# Altium project Board.PrjPcb
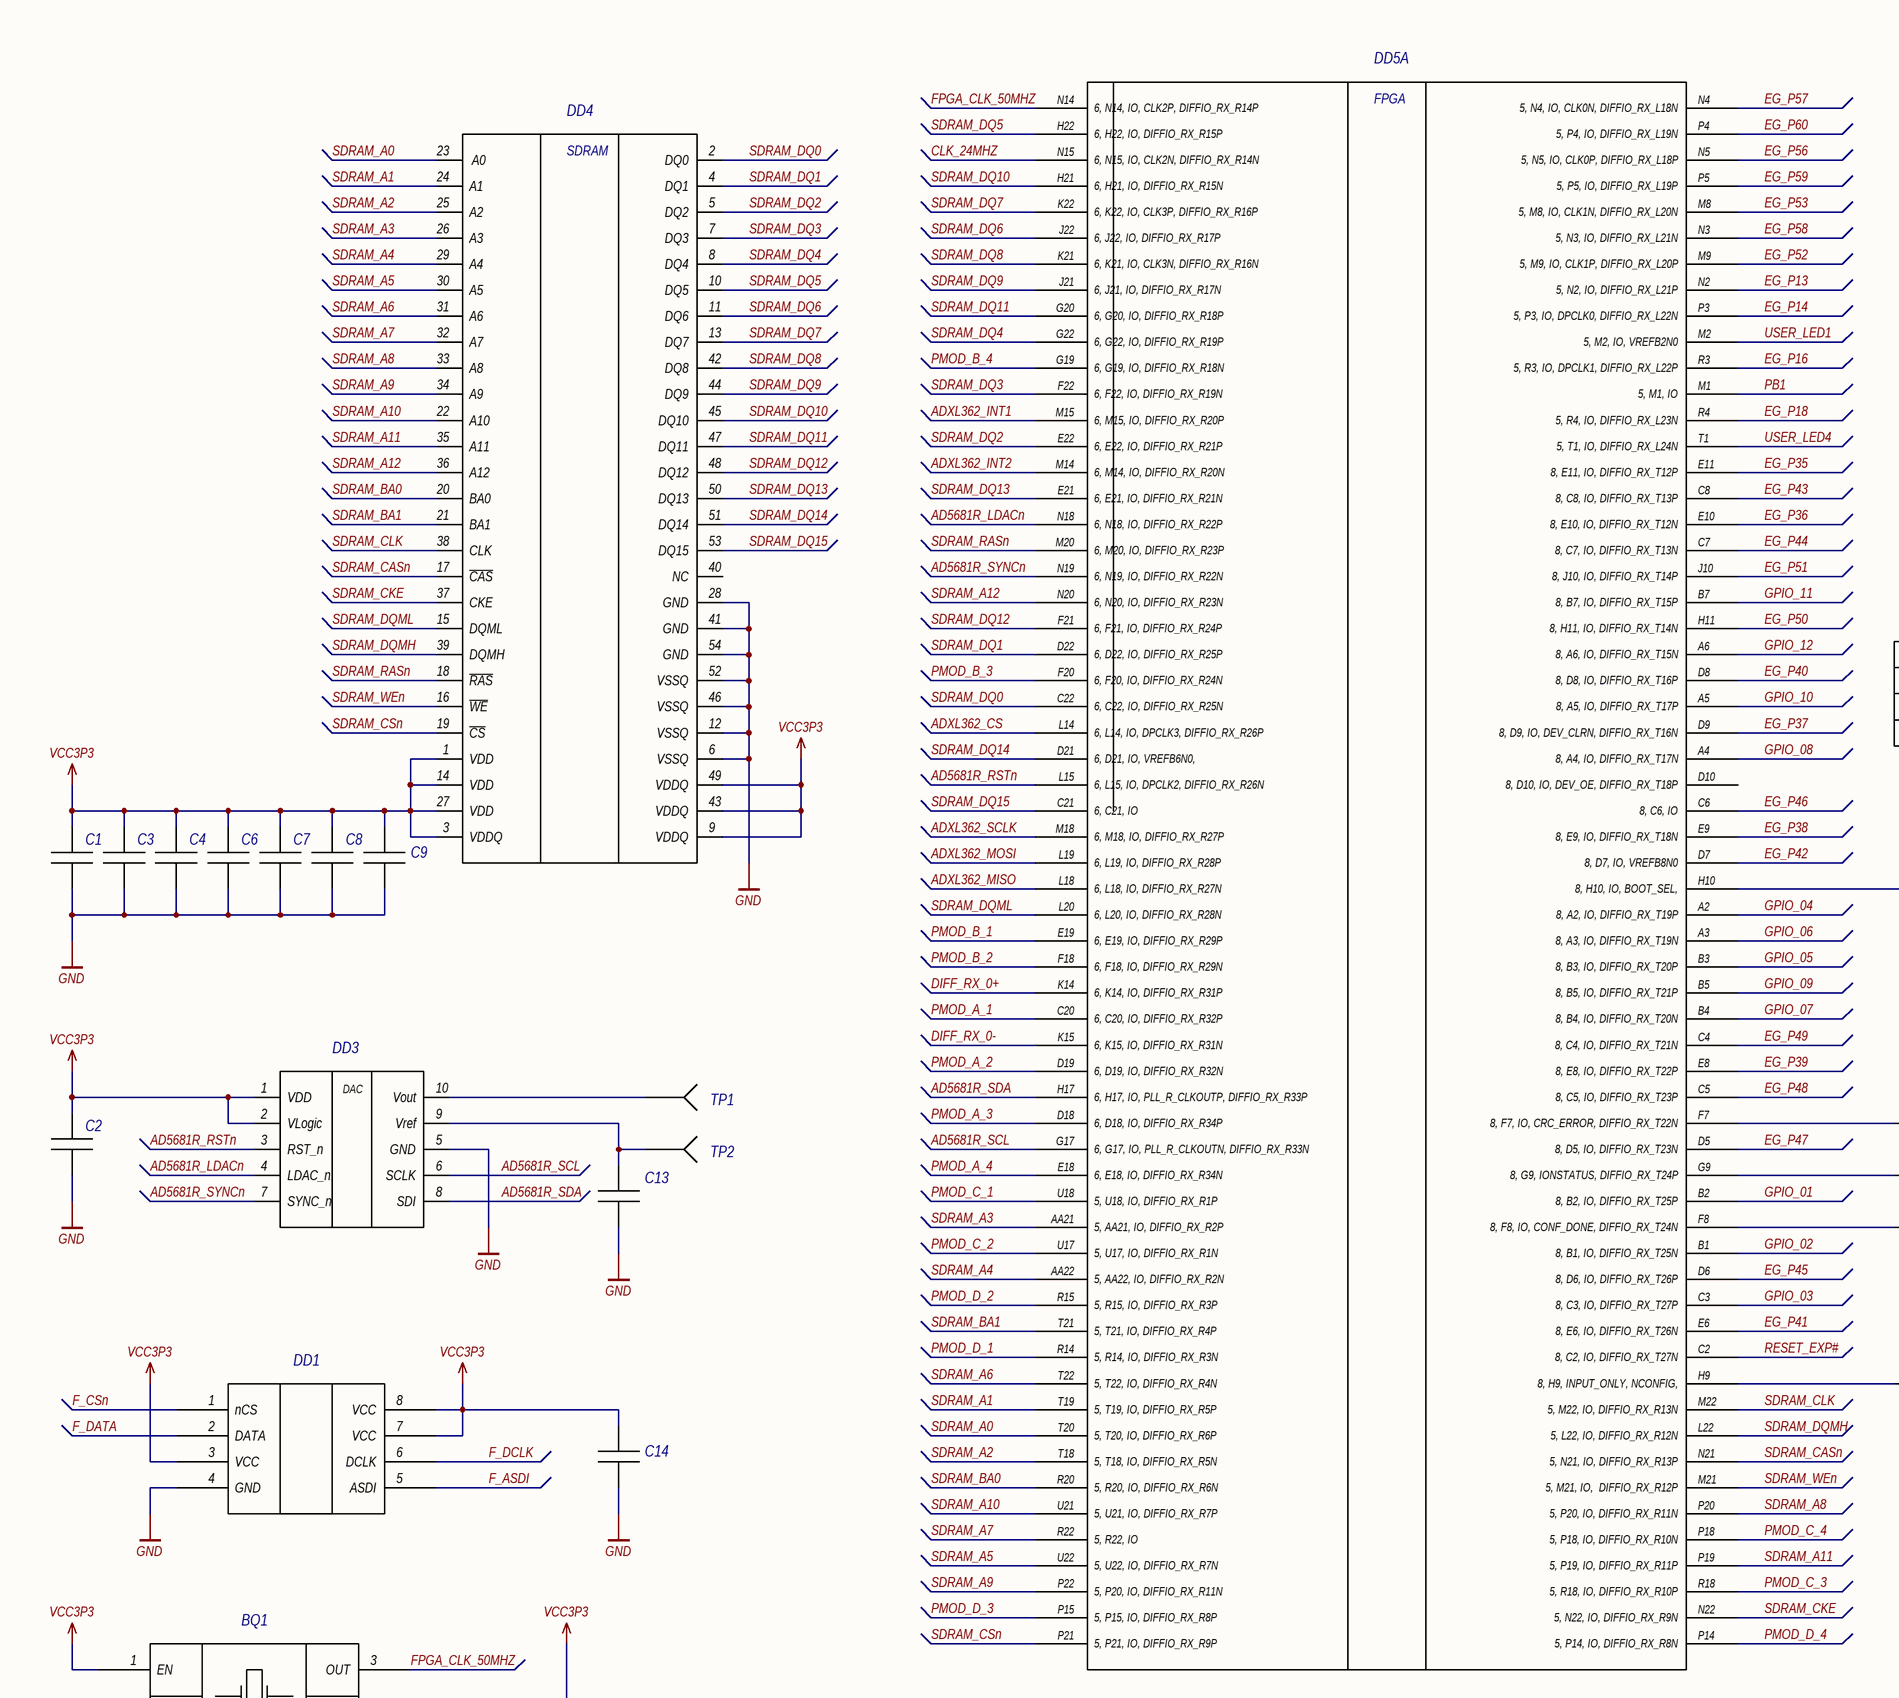
[diagram p0: 01.SchDoc, top left]
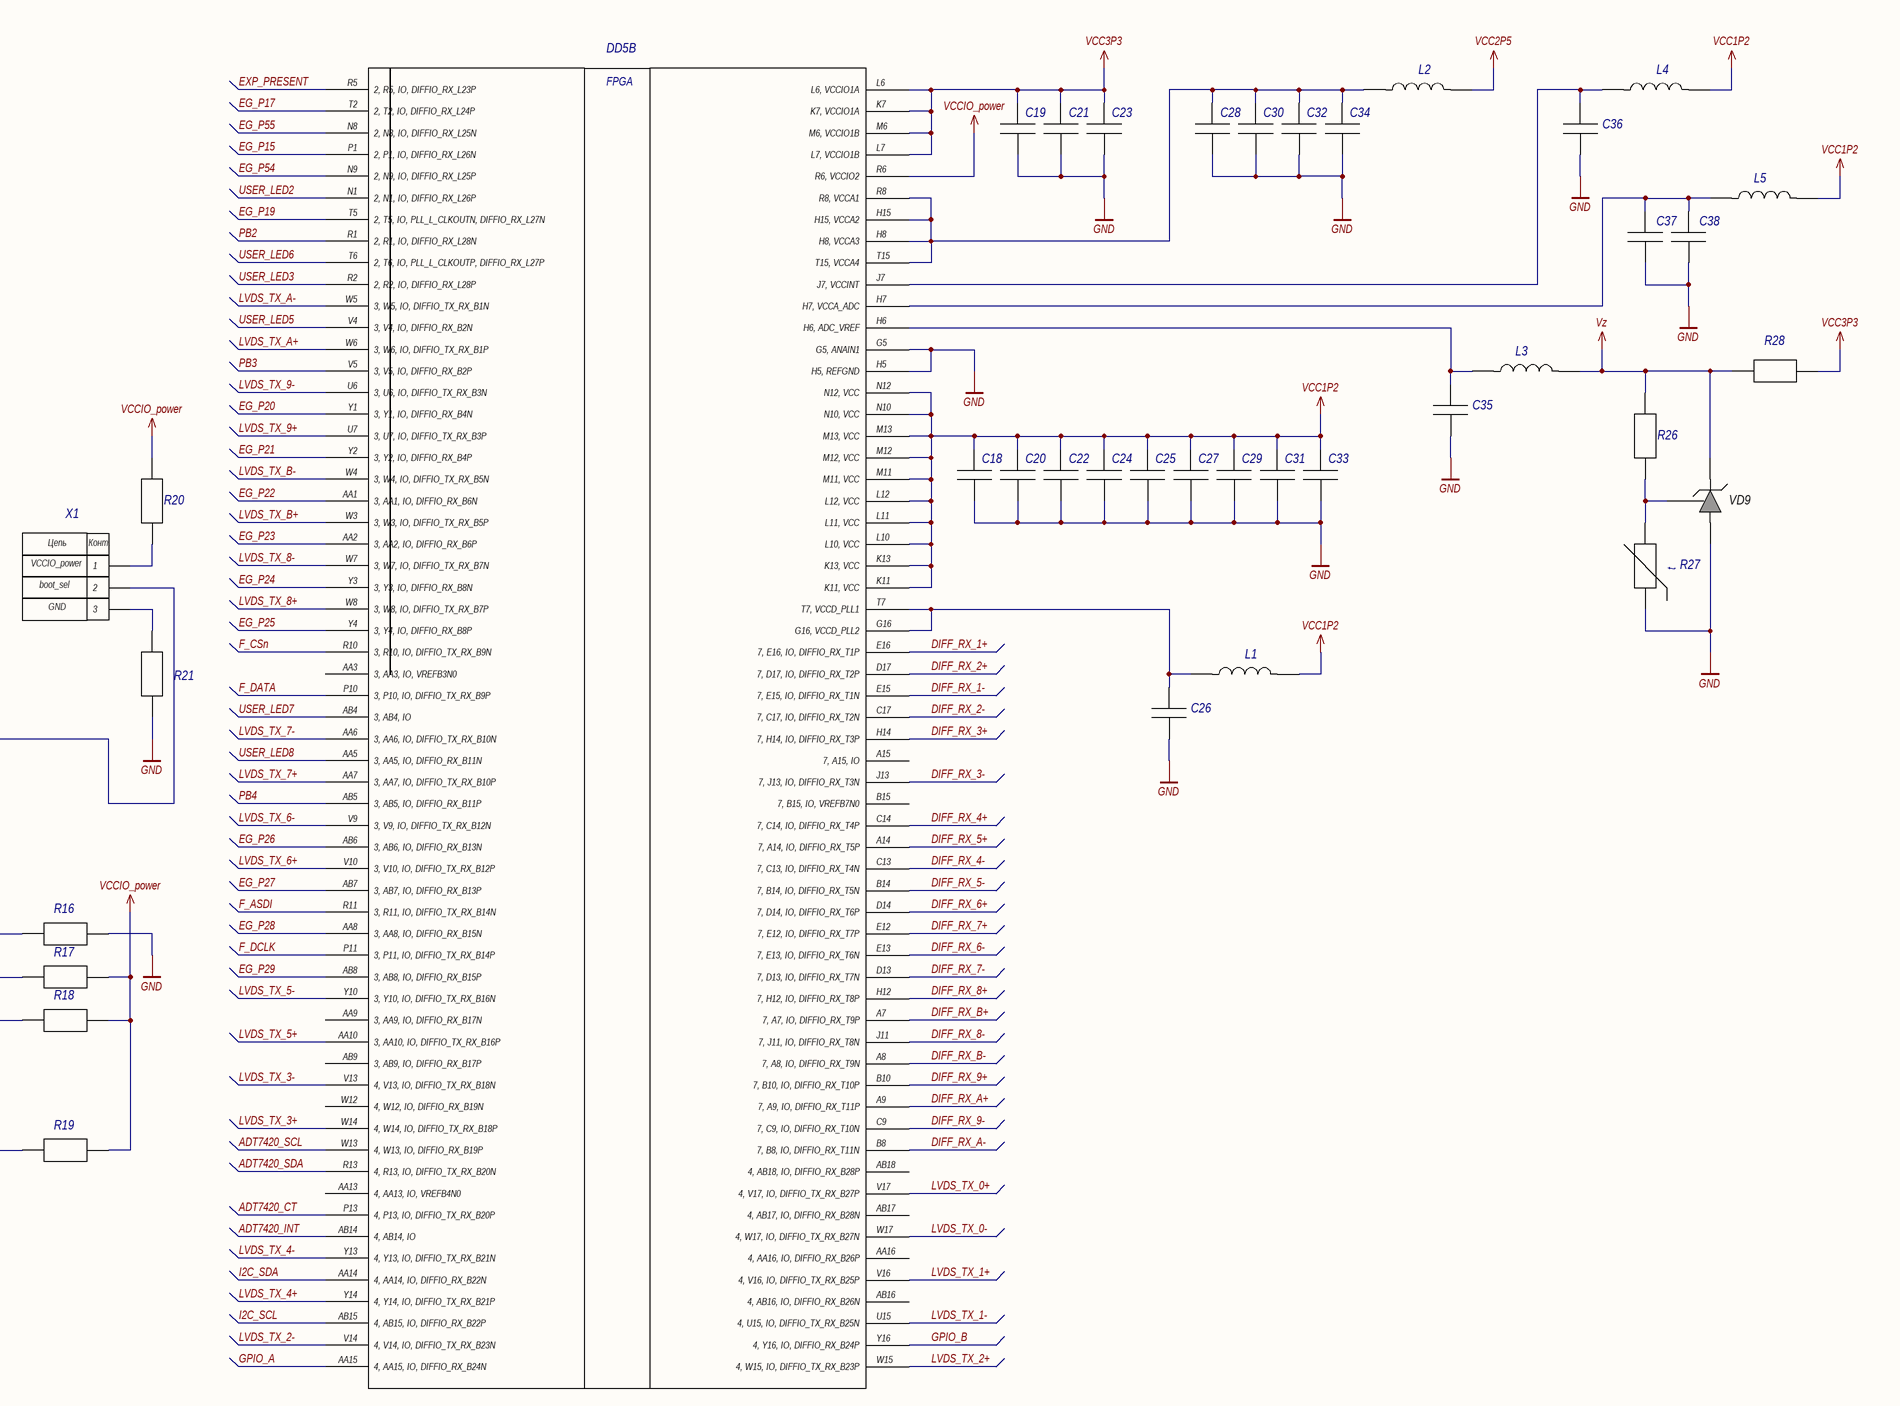
[diagram p1: 01.SchDoc, top right]
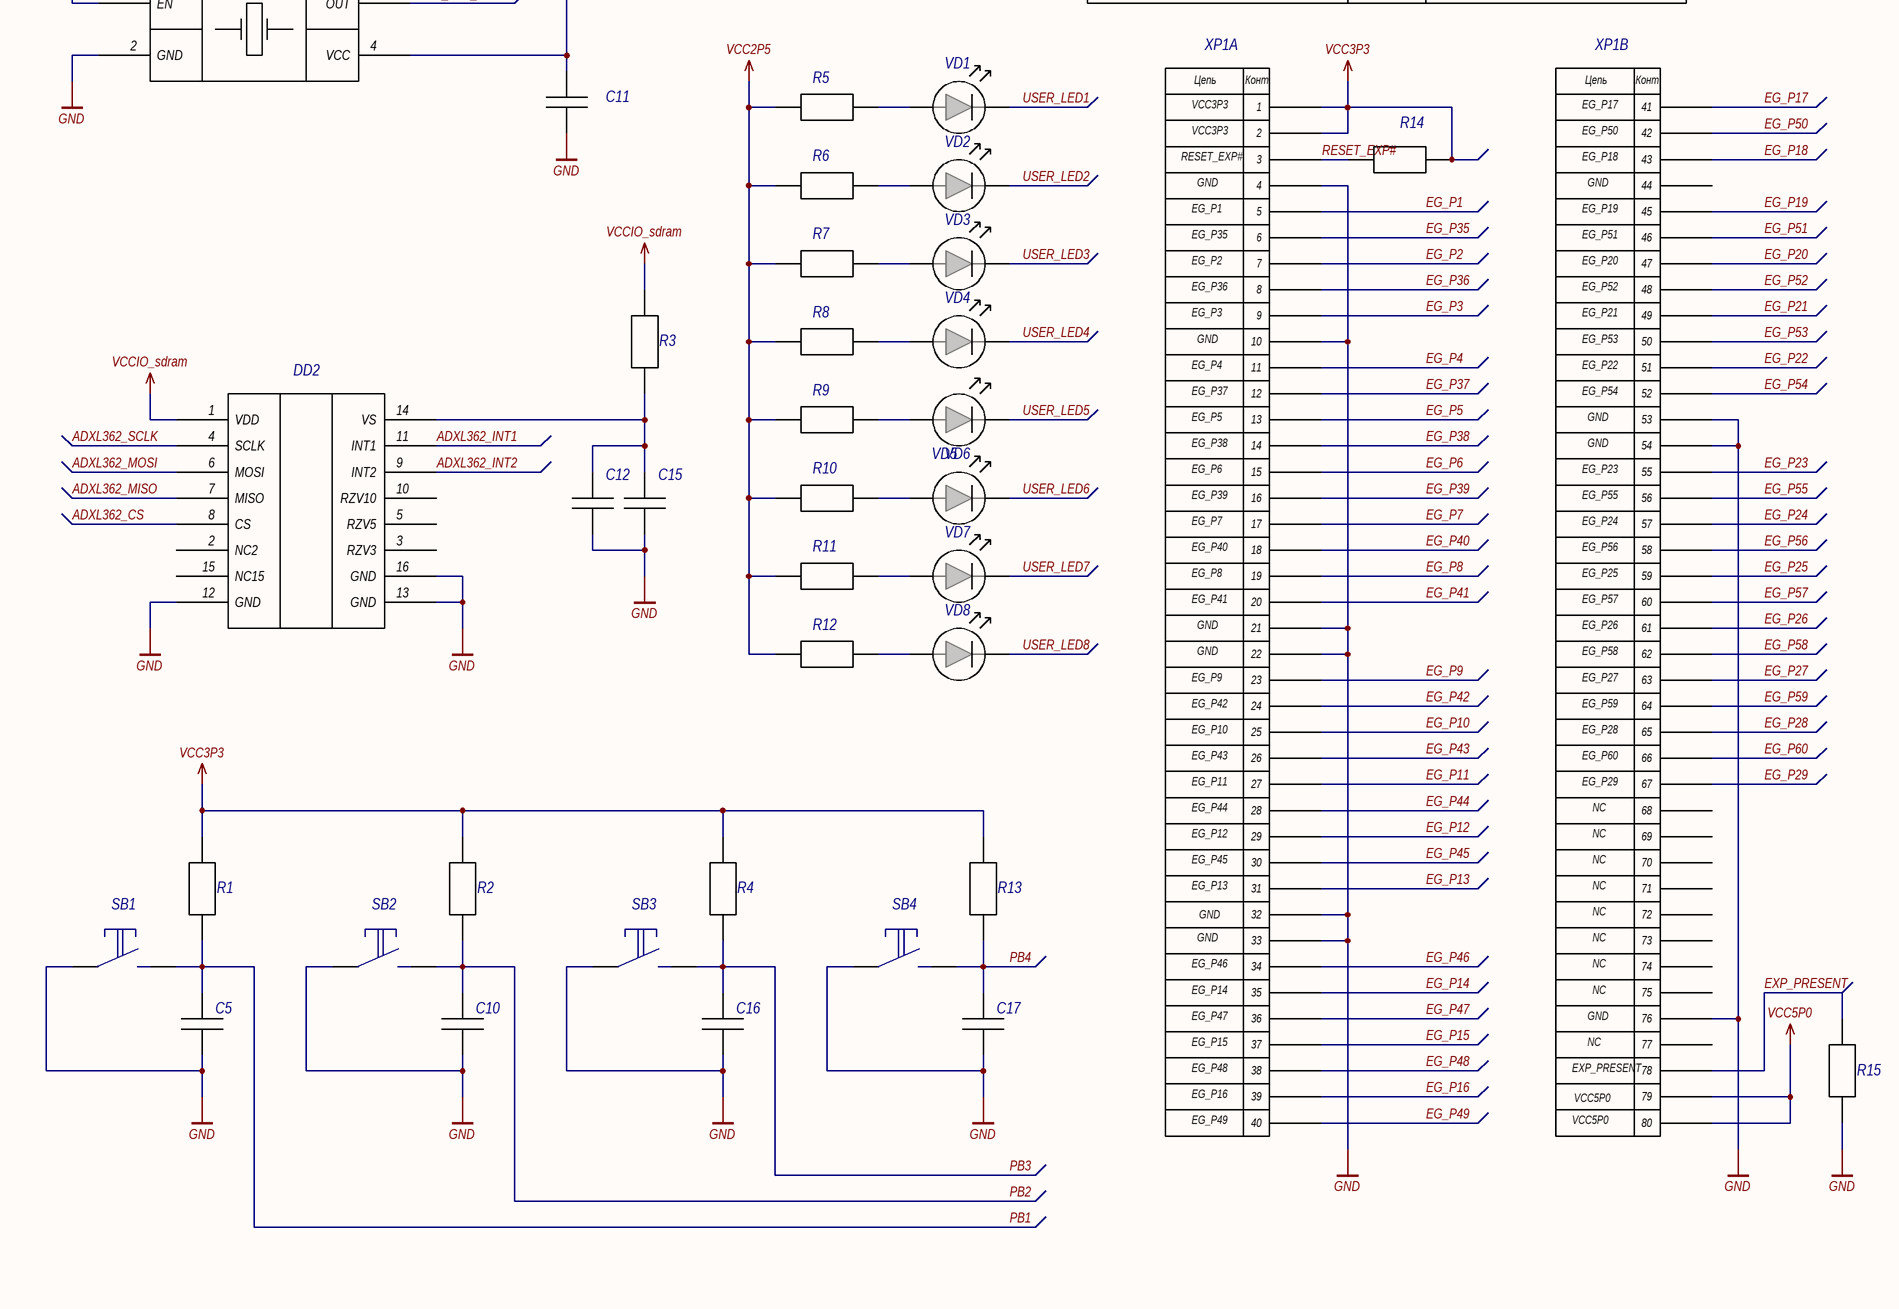
[diagram p2: 01.SchDoc, bottom left]
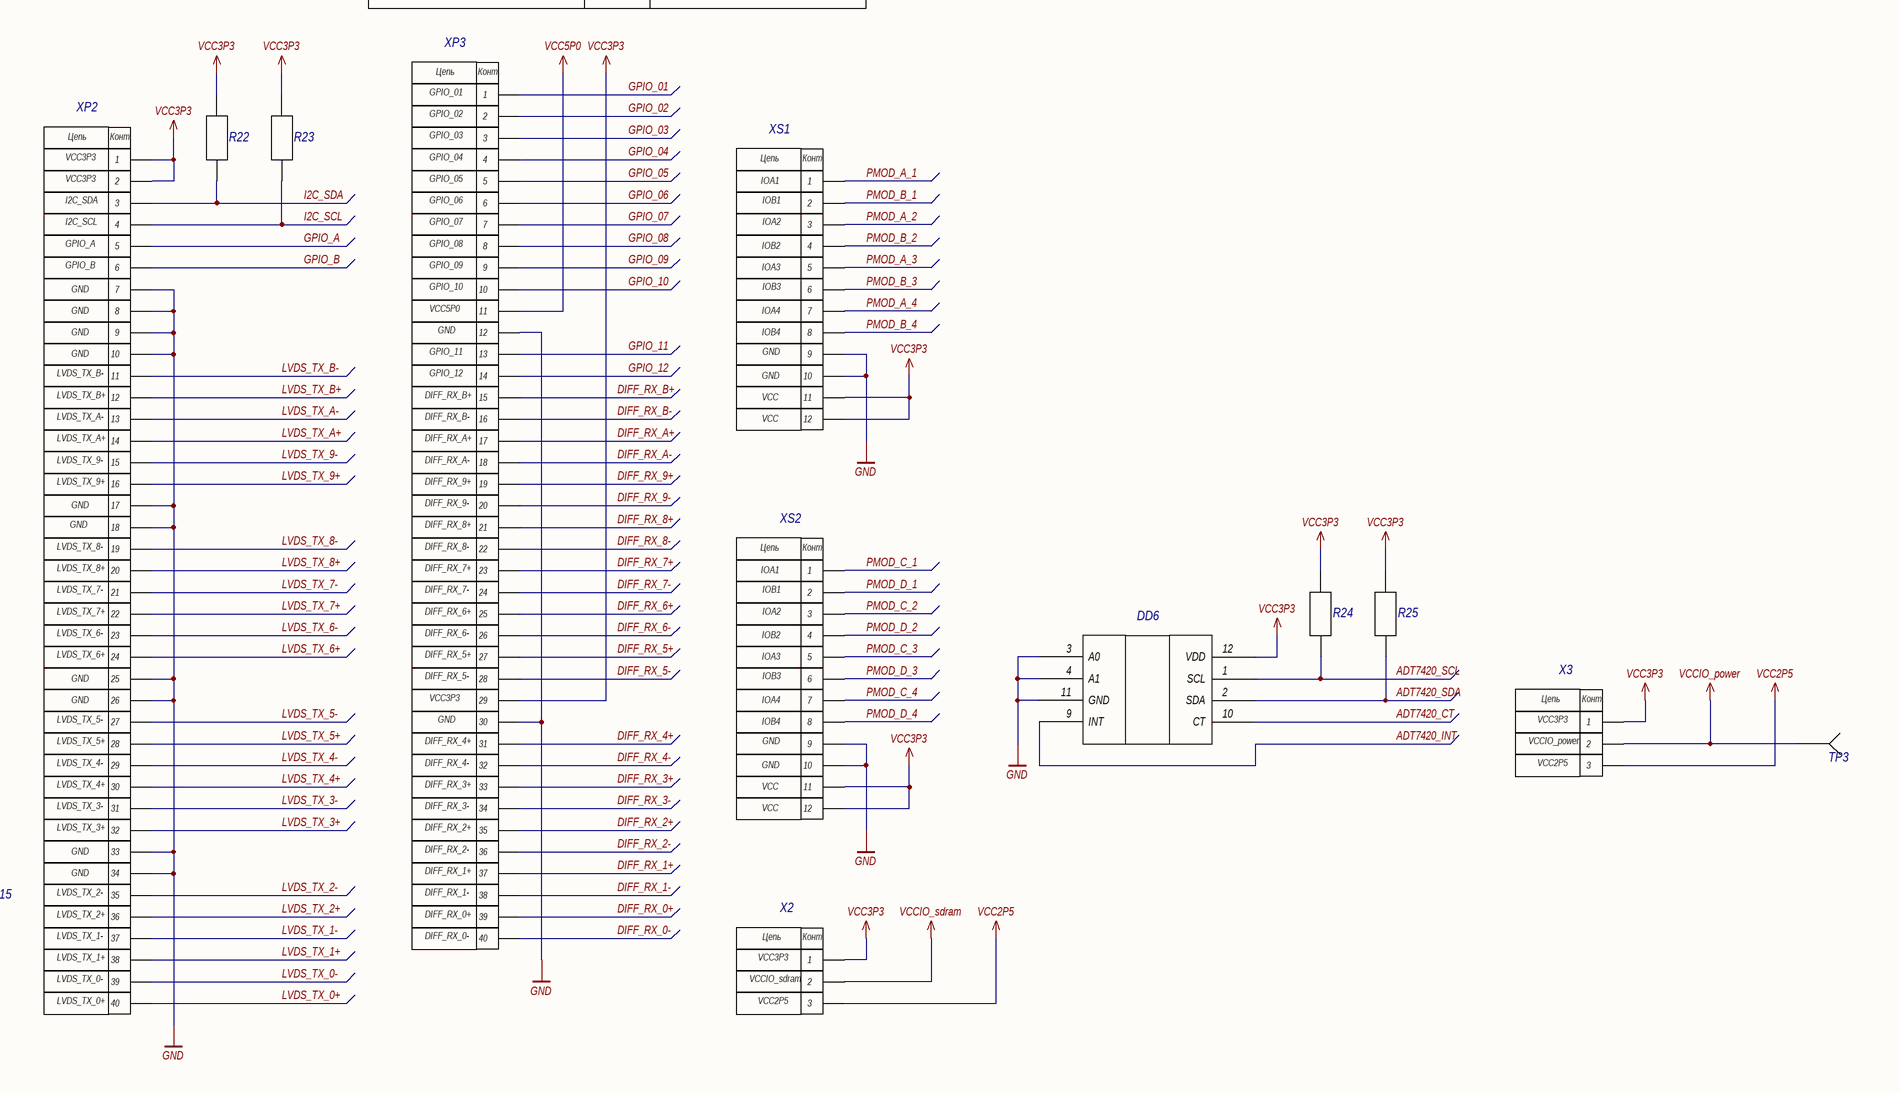
[diagram p3: 01.SchDoc, bottom right]
2 sheets, 242 parts. Net scope: global (net labels, ports and power ports of the same name join across sheets).
Board file: Mainboard.PcbDoc
Sheets:
  01.SchDoc
  02.SchDoc

## Sheet 01.SchDoc
size 840 x 594 mm; Разраб.: Гришель; Обозначение документа: ГУИР.421457.001 Э3; Пров.: Станкевич; Т.контр.: Станкевич; Н.контр.: Лихачёв; Утв.: Петровский; Номер листа: 1; Общее количество листов: 2; Литера: Т; Наименование организации: БГУИР, гр. 250701; Наименование изделия 1: Плата отладочная; Наименование изделия 2: Схема электрическая; Наименование изделия 3: принципиальная; Нач. отд.: Реценз.

### Parts
BQ1  Сlock 50 MHz 50ppm  [Crystal_Clock_SMD]  (value not drawn)
C1  1u  [CAPC0603X03L]  (value not drawn)
C2  100n  [Cap_0402]  (value not drawn)
C3  100n  [CAPC0603X03L]  (value not drawn)
C4  1u  [CAPC0603X03L]  (value not drawn)
C5  1u  [Cap_0402]  (value not drawn)
C6  100n  [CAPC0603X03L]  (value not drawn)
C7  1u  [CAPC0603X03L]  (value not drawn)
C8  100n  [CAPC0603X03L]  (value not drawn)
C9  10n  [CAPC0603X03L]  (value not drawn)
C10  1u  [Cap_0402]  (value not drawn)
C11  100n  [Cap_0402]  (value not drawn)
C12  1u  [Cap_0402]  (value not drawn)
C13  10n  [Cap_0402]  (value not drawn)
C14  100n  [Cap_0402]  (value not drawn)
C15  1u  [Cap_0402]  (value not drawn)
C16  1u  [Cap_0402]  (value not drawn)
C17  1u  [Cap_0402]  (value not drawn)
C18  10n  [CAPC0603X03L]  (value not drawn)
C19  100n  [CAPC0603X03L]  (value not drawn)
C20  10n  [CAPC0603X03L]  (value not drawn)
C21  100n  [CAPC0603X03L]  (value not drawn)
C22  10n  [CAPC0603X03L]  (value not drawn)
C23  10u  [Cap_0603]  (value not drawn)
C24  100n  [CAPC0603X03L]  (value not drawn)
C25  100n  [CAPC0603X03L]  (value not drawn)
C26  100n  [CAPC0603X03L]  (value not drawn)
C27  100n  [CAPC0603X03L]  (value not drawn)
C28  100n  [CAPC0603X03L]  (value not drawn)
C29  1u  [CAPC0603X03L]  (value not drawn)
C30  100n  [CAPC0603X03L]  (value not drawn)
C31  1u  [CAPC0603X03L]  (value not drawn)
C32  100n  [CAPC0603X03L]  (value not drawn)
C33  10u  [Cap_0603]  (value not drawn)
C34  100n  [CAPC0603X03L]  (value not drawn)
C35  100n  [CAPC0603X03L]  (value not drawn)
C36  100n  [CAPC0603X03L]  (value not drawn)
C37  100n  [CAPC0603X03L]  (value not drawn)
C38  10u  [Cap_0603]  (value not drawn)
DD1  16Mb serial flash M25P16-VMN6  [M25P16-VMN6 _serial_flash]  (value not drawn)
DD2  Accelerometer 16 pins  [ADXL362_Accelerometer]  (value not drawn)
DD3  12-bit DAC  [AD5681R_12-bit DAC]  (value not drawn)
DD4  SDRAM 8 MB 54 pins  [SDRAM_IS42S16400J-7TL]  (value not drawn)
DD5  MAX 10 FPGFA  [10M08DAF484_V2]  (value not drawn)  (parts A,B of 3)
DD6  Temperature sensor ADT7420  [ADT7420_temperature sensor]  (value not drawn)
L1  4.7u  [Inductor]  (value not drawn)
L2  4.7u  [Inductor]  (value not drawn)
L3  4.7u  [Inductor]  (value not drawn)
L4  4.7u  [Inductor]  (value not drawn)
L5  4.7u  [Inductor]  (value not drawn)
R1  10k  [RESISTOR_0402]  (value not drawn)
R2  10k  [RESISTOR_0402]  (value not drawn)
R3  0  [RESISTOR_0402]  (value not drawn)
R4  10k  [RESISTOR_0402]  (value not drawn)
R5  220  [Resistor_0603]  (value not drawn)
R6  220  [Resistor_0603]  (value not drawn)
R7  220  [Resistor_0603]  (value not drawn)
R8  220  [Resistor_0603]  (value not drawn)
R9  220  [Resistor_0603]  (value not drawn)
R10  220  [Resistor_0603]  (value not drawn)
R11  220  [Resistor_0603]  (value not drawn)
R12  220  [Resistor_0603]  (value not drawn)
R13  10k  [RESISTOR_0402]  (value not drawn)
R14  10k  [RESISTOR_0402]  (value not drawn)
R15  10k  [RESISTOR_0402]  (value not drawn)
R16  10k  [RESISTOR_0402]  (value not drawn)
R17  10k  [RESISTOR_0402]  (value not drawn)
R18  10k  [RESISTOR_0402]  (value not drawn)
R19  10k  [RESISTOR_0402]  (value not drawn)
R20  10k  [RESISTOR_0402]  (value not drawn)
R21  10k  [RESISTOR_0402]  (value not drawn)
R22  4.7k  [RESISTOR_0402]  (value not drawn)
R23  4.7k  [RESISTOR_0402]  (value not drawn)
R24  4.7k  [RESISTOR_0402]  (value not drawn)
R25  4.7k  [RESISTOR_0402]  (value not drawn)
R26  12.1k  [RESISTOR_0402]  (value not drawn)
R27  *  [Thermistor]  (value not drawn)
R28  330  [RESISTOR_0402]  (value not drawn)
SB1  Button  [Button_SMD]  (value not drawn)
SB2  Button  [Button_SMD]  (value not drawn)
SB3  Button  [Button_SMD]  (value not drawn)
SB4  Button  [Button_SMD]  (value not drawn)
TP1  Testpoint  [TP]  (value not drawn)  (no BOM)
TP2  Testpoint  [TP]  (value not drawn)  (no BOM)
TP3  Testpoint  [TP]  (value not drawn)  (no BOM)
VD1  LED_green  [LED_smd]  (value not drawn)
VD2  LED_green  [LED_smd]  (value not drawn)
VD3  LED_green  [LED_smd]  (value not drawn)
VD4  LED_green  [LED_smd]  (value not drawn)
VD5  LED_green  [LED_smd]  (value not drawn)
VD6  LED_green  [LED_smd]  (value not drawn)
VD7  LED_green  [LED_smd]  (value not drawn)
VD8  LED_green  [LED_smd]  (value not drawn)
VD9  0-Diode  [Diode_BAT54C]  (value not drawn)
X1  Jumper_J3  [CONN_J3_PIN_HEADER_1x3_2.54mm _bootselect]  (value not drawn)
X2  Jumper_J9  [CONN_J1,J9_PIN_HEADER_1x3_2.0mm]  (value not drawn)
X3  Jumper_J1  [CONN_J1,J9_PIN_HEADER_1x3_2.0mm]  (value not drawn)
XP1  80-pin edge connector (J2)  [MEC6-140-02-S-DV-A]  (value not drawn)  (parts A,B of 2)
XP2  2x20 pin headers (J4)  [CONN_J4,J5_PIN_HEADER_2x20_2.54mm]  (value not drawn)
XP3  2x20 pin headers (J5)  [CONN_J4,J5_PIN_HEADER_2x20_2.54mm]  (value not drawn)
XS1  Сonnector  PMOD Female Header  [CONN_U5, U6_Female Header 2x6, 2.54mm]  (value not drawn)
XS2  Сonnector  PMOD Female Header  [CONN_U5, U6_Female Header 2x6, 2.54mm]  (value not drawn)

### Nets
GND: BQ1.2(GND) C1.1 C2.1 C3.1 C4.1 C5.2 C6.1 C7.1 C8.1 C9.1 C10.2 C11.1 C12.1 C13.1 C14.1 C15.1 C16.2 C17.2 C18.1 C19.1 C20.1 C21.1 C22.1 C23.1 C24.1 C25.1 C26.1 C27.1 C28.1 C29.1 C30.1 C31.1 C32.1 C33.1 C34.1 C35.1 C36.1 C37.1 C38.1 DD1.4(GND) DD2.12(GND) DD2.13(GND) DD2.16(GND) DD2.17 DD3.5(GND) DD4.6(VSSQ) DD4.12(VSSQ) DD4.28(GND) DD4.41(GND) DD4.46(VSSQ) DD4.52(VSSQ) DD4.54(GND) DD5.G5(G5,_ANAIN1) DD5.H5(H5,_REFGND) DD6.3(A0) DD6.4(A1) DD6.11(GND) DD6.17 R15.1 R16.2 R21.1 R27.1 SB1.1 SB2.1 SB3.1 SB4.1 VD9.3(Anode) XP1.4 XP1.10 XP1.21 XP1.22 XP1.32 XP1.33 XP1.53 XP1.54 XP1.76 XP2.7 XP2.8 XP2.9 XP2.10 XP2.17 XP2.18 XP2.25 XP2.26 XP2.33 XP2.34 XP3.12 XP3.30 XS1.9 XS1.10 XS2.9 XS2.10
VCC1P2: C18.2 C20.2 C22.2 C24.2 C25.2 C27.2 C29.2 C31.2 C33.2 DD5.K11(K11,_VCC) DD5.K13(K13,_VCC) DD5.L10(L10,_VCC) DD5.L11(L11,_VCC) DD5.L12(L12,_VCC) DD5.M11(M11,_VCC) DD5.M12(M12,_VCC) DD5.M13(M13,_VCC) DD5.N10(N10,_VCC) DD5.N12(N12,_VCC) L1.2 L4.2 L5.2
VCC2P5: L2.2 R5.2 R6.2 R7.2 R8.2 R9.2 R10.2 R11.2 R12.2 X2.3 X3.3
VCC3P3: BQ1.1(EN) BQ1.4(VCC) C1.2 C2.2 C3.2 C4.2 C6.2 C7.2 C8.2 C9.2 C11.2 C14.2 C19.2 C21.2 C23.2 DD1.3(VCC) DD1.7(VCC) DD1.8(VCC) DD3.1(VDD) DD3.2(VLogic) DD4.1(VDD) DD4.3(VDDQ) DD4.9(VDDQ) DD4.14(VDD) DD4.27(VDD) DD4.43(VDDQ) DD4.49(VDDQ) DD5.K7(K7,_VCCIO1A) DD5.L6(L6,_VCCIO1A) DD5.L7(L7,_VCCIO1B) DD5.M6(M6,_VCCIO1B) DD6.12(VDD) R1.2 R2.2 R4.2 R13.2 R14.1 R22.2 R23.2 R24.2 R25.2 R28.1 X2.1 X3.1 XP1.1 XP1.2 XP2.1 XP2.2 XP3.29 XS1.11 XS1.12 XS2.11 XS2.12
VCC5P0: XP1.79 XP1.80 XP3.11
VCCIO_power: DD5.R6(R6,_VCCIO2) R17.2 R18.2 R19.2 R20.2 TP3.1(Pad) X3.2
VCCIO_sdram: DD2.1(VDD) R3.2 X2.2
Vz: L3.2 R26.2 R28.2 VD9.2(Cathode)
AD5681R_LDACn: DD3.4(LDAC_n) DD5.N18(6,_N18,_IO,_DIFFIO_RX_R22P)
AD5681R_RSTn: DD3.3(RST_n) DD5.L15(6,_L15,_IO,_DPCLK2,_DIFFIO_RX_R26N)
AD5681R_SCL: DD3.6(SCLK) DD5.G17(6,_G17,_IO,_PLL_R_CLKOUTN,_DIFFIO_RX_R33N)
AD5681R_SDA: DD3.8(SDI) DD5.H17(6,_H17,_IO,_PLL_R_CLKOUTP,_DIFFIO_RX_R33P)
AD5681R_SYNCn: DD3.7(SYNC_n) DD5.N19(6,_N19,_IO,_DIFFIO_RX_R22N)
ADT7420_CT: DD5.P13(4,_P13,_IO,_DIFFIO_TX_RX_B20P) DD6.10(CT)
ADT7420_INT: DD5.AB14(4,_AB14,_IO) DD6.9(INT)
ADT7420_SCL: DD5.W13(4,_W13,_IO,_DIFFIO_RX_B19P) DD6.1(SCL) R24.1
ADT7420_SDA: DD5.R13(4,_R13,_IO,_DIFFIO_TX_RX_B20N) DD6.2(SDA) R25.1
ADXL362_CS: DD2.8(CS) DD5.L14(6,_L14,_IO,_DPCLK3,_DIFFIO_RX_R26P)
ADXL362_INT1: DD2.11(INT1) DD5.M15(6,_M15,_IO,_DIFFIO_RX_R20P)
ADXL362_INT2: DD2.9(INT2) DD5.M14(6,_M14,_IO,_DIFFIO_RX_R20N)
ADXL362_MISO: DD2.7(MISO) DD5.L18(6,_L18,_IO,_DIFFIO_RX_R27N)
ADXL362_MOSI: DD2.6(MOSI) DD5.L19(6,_L19,_IO,_DIFFIO_RX_R28P)
ADXL362_SCLK: DD2.4(SCLK) DD5.M18(6,_M18,_IO,_DIFFIO_RX_R27P)
CLK_24MHZ: DD5.N15(6,_N15,_IO,_CLK2N,_DIFFIO_RX_R14N)
DIFF_RX_0+: DD5.K14(6,_K14,_IO,_DIFFIO_RX_R31P) XP3.39
DIFF_RX_0-: DD5.K15(6,_K15,_IO,_DIFFIO_RX_R31N) XP3.40
DIFF_RX_1+: DD5.E16(7,_E16,_IO,_DIFFIO_RX_T1P) XP3.37
DIFF_RX_1-: DD5.E15(7,_E15,_IO,_DIFFIO_RX_T1N) XP3.38
DIFF_RX_2+: DD5.D17(7,_D17,_IO,_DIFFIO_RX_T2P) XP3.35
DIFF_RX_2-: DD5.C17(7,_C17,_IO,_DIFFIO_RX_T2N) XP3.36
DIFF_RX_3+: DD5.H14(7,_H14,_IO,_DIFFIO_RX_T3P) XP3.33
DIFF_RX_3-: DD5.J13(7,_J13,_IO,_DIFFIO_RX_T3N) XP3.34
DIFF_RX_4+: DD5.C14(7,_C14,_IO,_DIFFIO_RX_T4P) XP3.31
DIFF_RX_4-: DD5.C13(7,_C13,_IO,_DIFFIO_RX_T4N) XP3.32
DIFF_RX_5+: DD5.A14(7,_A14,_IO,_DIFFIO_RX_T5P) XP3.27
DIFF_RX_5-: DD5.B14(7,_B14,_IO,_DIFFIO_RX_T5N) XP3.28
DIFF_RX_6+: DD5.D14(7,_D14,_IO,_DIFFIO_RX_T6P) XP3.25
DIFF_RX_6-: DD5.E13(7,_E13,_IO,_DIFFIO_RX_T6N) XP3.26
DIFF_RX_7+: DD5.E12(7,_E12,_IO,_DIFFIO_RX_T7P) XP3.23
DIFF_RX_7-: DD5.D13(7,_D13,_IO,_DIFFIO_RX_T7N) XP3.24
DIFF_RX_8+: DD5.H12(7,_H12,_IO,_DIFFIO_RX_T8P) XP3.21
DIFF_RX_8-: DD5.J11(7,_J11,_IO,_DIFFIO_RX_T8N) XP3.22
DIFF_RX_9+: DD5.B10(7,_B10,_IO,_DIFFIO_RX_T10P) XP3.19
DIFF_RX_9-: DD5.C9(7,_C9,_IO,_DIFFIO_RX_T10N) XP3.20
DIFF_RX_A+: DD5.A9(7,_A9,_IO,_DIFFIO_RX_T11P) XP3.17
DIFF_RX_A-: DD5.B8(7,_B8,_IO,_DIFFIO_RX_T11N) XP3.18
DIFF_RX_B+: DD5.A7(7,_A7,_IO,_DIFFIO_RX_T9P) XP3.15
DIFF_RX_B-: DD5.A8(7,_A8,_IO,_DIFFIO_RX_T9N) XP3.16
EG_P1: XP1.5
EG_P2: XP1.7
EG_P3: XP1.9
EG_P4: XP1.11
EG_P5: XP1.13
EG_P6: XP1.15
EG_P7: XP1.17
EG_P8: XP1.19
EG_P9: XP1.23
EG_P10: XP1.25
EG_P11: XP1.27
EG_P12: XP1.29
EG_P13: DD5.N2(5,_N2,_IO,_DIFFIO_RX_L21P) XP1.31
EG_P14: DD5.P3(5,_P3,_IO,_DPCLK0,_DIFFIO_RX_L22N) XP1.35
EG_P15: DD5.P1(2,_P1,_IO,_DIFFIO_RX_L26N) XP1.37
EG_P16: DD5.R3(5,_R3,_IO,_DPCLK1,_DIFFIO_RX_L22P) XP1.39
EG_P17: DD5.T2(2,_T2,_IO,_DIFFIO_RX_L24P) XP1.41
EG_P18: DD5.R4(5,_R4,_IO,_DIFFIO_RX_L23N) XP1.43
EG_P19: DD5.T5(2,_T5,_IO,_PLL_L_CLKOUTN,_DIFFIO_RX_L27N) XP1.45
EG_P20: DD5.Y1(3,_Y1,_IO,_DIFFIO_RX_B4N) XP1.47
EG_P21: DD5.Y2(3,_Y2,_IO,_DIFFIO_RX_B4P) XP1.49
EG_P22: DD5.AA1(3,_AA1,_IO,_DIFFIO_RX_B6N) XP1.51
EG_P23: DD5.AA2(3,_AA2,_IO,_DIFFIO_RX_B6P) XP1.55
EG_P24: DD5.Y3(3,_Y3,_IO,_DIFFIO_RX_B8N) XP1.57
EG_P25: DD5.Y4(3,_Y4,_IO,_DIFFIO_RX_B8P) XP1.59
EG_P26: DD5.AB6(3,_AB6,_IO,_DIFFIO_RX_B13N) XP1.61
EG_P27: DD5.AB7(3,_AB7,_IO,_DIFFIO_RX_B13P) XP1.63
EG_P28: DD5.AA8(3,_AA8,_IO,_DIFFIO_RX_B15N) XP1.65
EG_P29: DD5.AB8(3,_AB8,_IO,_DIFFIO_RX_B15P) XP1.67
EG_P35: DD5.E11(8,_E11,_IO,_DIFFIO_RX_T12P) XP1.6
EG_P36: DD5.E10(8,_E10,_IO,_DIFFIO_RX_T12N) XP1.8
EG_P37: DD5.D9(8,_D9,_IO,_DEV_CLRN,_DIFFIO_RX_T16N) XP1.12
EG_P38: DD5.E9(8,_E9,_IO,_DIFFIO_RX_T18N) XP1.14
EG_P39: DD5.E8(8,_E8,_IO,_DIFFIO_RX_T22P) XP1.16
EG_P40: DD5.D8(8,_D8,_IO,_DIFFIO_RX_T16P) XP1.18
EG_P41: DD5.E6(8,_E6,_IO,_DIFFIO_RX_T26N) XP1.20
EG_P42: DD5.D7(8,_D7,_IO,_VREFB8N0) XP1.24
EG_P43: DD5.C8(8,_C8,_IO,_DIFFIO_RX_T13P) XP1.26
EG_P44: DD5.C7(8,_C7,_IO,_DIFFIO_RX_T13N) XP1.28
EG_P45: DD5.D6(8,_D6,_IO,_DIFFIO_RX_T26P) XP1.30
EG_P46: DD5.C6(8,_C6,_IO) XP1.34
EG_P47: DD5.D5(8,_D5,_IO,_DIFFIO_RX_T23N) XP1.36
EG_P48: DD5.C5(8,_C5,_IO,_DIFFIO_RX_T23P) XP1.38
EG_P49: DD5.C4(8,_C4,_IO,_DIFFIO_RX_T21N) XP1.40
EG_P50: DD5.H11(8,_H11,_IO,_DIFFIO_RX_T14N) XP1.42
EG_P51: DD5.J10(8,_J10,_IO,_DIFFIO_RX_T14P) XP1.46
EG_P52: DD5.M9(5,_M9,_IO,_CLK1P,_DIFFIO_RX_L20P) XP1.48
EG_P53: DD5.M8(5,_M8,_IO,_CLK1N,_DIFFIO_RX_L20N) XP1.50
EG_P54: DD5.N9(2,_N9,_IO,_DIFFIO_RX_L25P) XP1.52
EG_P55: DD5.N8(2,_N8,_IO,_DIFFIO_RX_L25N) XP1.56
EG_P56: DD5.N5(5,_N5,_IO,_CLK0P,_DIFFIO_RX_L18P) XP1.58
EG_P57: DD5.N4(5,_N4,_IO,_CLK0N,_DIFFIO_RX_L18N) XP1.60
EG_P58: DD5.N3(5,_N3,_IO,_DIFFIO_RX_L21N) XP1.62
EG_P59: DD5.P5(5,_P5,_IO,_DIFFIO_RX_L19P) XP1.64
EG_P60: DD5.P4(5,_P4,_IO,_DIFFIO_RX_L19N) XP1.66
EXP_PRESENT: DD5.R5(2,_R5,_IO,_DIFFIO_RX_L23P) R15.2 XP1.78
F_ASDI: DD1.5(ASDI) DD5.R11(3,_R11,_IO,_DIFFIO_TX_RX_B14N)
F_CSn: DD1.1(nCS) DD5.R10(3,_R10,_IO,_DIFFIO_TX_RX_B9N)
F_DATA: DD1.2(DATA) DD5.P10(3,_P10,_IO,_DIFFIO_TX_RX_B9P)
F_DCLK: DD1.6(DCLK) DD5.P11(3,_P11,_IO,_DIFFIO_TX_RX_B14P)
FPGA_CLK_50MHZ: BQ1.3(OUT) DD5.N14(6,_N14,_IO,_CLK2P,_DIFFIO_RX_R14P)
GPIO_01: DD5.B2(8,_B2,_IO,_DIFFIO_RX_T25P) XP3.1
GPIO_02: DD5.B1(8,_B1,_IO,_DIFFIO_RX_T25N) XP3.2
GPIO_03: DD5.C3(8,_C3,_IO,_DIFFIO_RX_T27P) XP3.3
GPIO_04: DD5.A2(8,_A2,_IO,_DIFFIO_RX_T19P) XP3.4
GPIO_05: DD5.B3(8,_B3,_IO,_DIFFIO_RX_T20P) XP3.5
GPIO_06: DD5.A3(8,_A3,_IO,_DIFFIO_RX_T19N) XP3.6
GPIO_07: DD5.B4(8,_B4,_IO,_DIFFIO_RX_T20N) XP3.7
GPIO_08: DD5.A4(8,_A4,_IO,_DIFFIO_RX_T17N) XP3.8
GPIO_09: DD5.B5(8,_B5,_IO,_DIFFIO_RX_T21P) XP3.9
GPIO_10: DD5.A5(8,_A5,_IO,_DIFFIO_RX_T17P) XP3.10
GPIO_11: DD5.B7(8,_B7,_IO,_DIFFIO_RX_T15P) XP3.13
GPIO_12: DD5.A6(8,_A6,_IO,_DIFFIO_RX_T15N) XP3.14
GPIO_A: DD5.AA15(4,_AA15,_IO,_DIFFIO_RX_B24N) XP2.5
GPIO_B: DD5.Y16(4,_Y16,_IO,_DIFFIO_RX_B24P) XP2.6
I2C_SCL: DD5.AB15(4,_AB15,_IO,_DIFFIO_RX_B22P) R23.1 XP2.4
I2C_SDA: DD5.AA14(4,_AA14,_IO,_DIFFIO_RX_B22N) R22.1 XP2.3
LVDS_TX_0+: DD5.V17(4,_V17,_IO,_DIFFIO_TX_RX_B27P) XP2.40
LVDS_TX_0-: DD5.W17(4,_W17,_IO,_DIFFIO_TX_RX_B27N) XP2.39
LVDS_TX_1+: DD5.V16(4,_V16,_IO,_DIFFIO_TX_RX_B25P) XP2.38
LVDS_TX_1-: DD5.U15(4,_U15,_IO,_DIFFIO_TX_RX_B25N) XP2.37
LVDS_TX_2+: DD5.W15(4,_W15,_IO,_DIFFIO_TX_RX_B23P) XP2.36
LVDS_TX_2-: DD5.V14(4,_V14,_IO,_DIFFIO_TX_RX_B23N) XP2.35
LVDS_TX_3+: DD5.W14(4,_W14,_IO,_DIFFIO_TX_RX_B18P) XP2.32
LVDS_TX_3-: DD5.V13(4,_V13,_IO,_DIFFIO_TX_RX_B18N) XP2.31
LVDS_TX_4+: DD5.Y14(4,_Y14,_IO,_DIFFIO_TX_RX_B21P) XP2.30
LVDS_TX_4-: DD5.Y13(4,_Y13,_IO,_DIFFIO_TX_RX_B21N) XP2.29
LVDS_TX_5+: DD5.AA10(3,_AA10,_IO,_DIFFIO_TX_RX_B16P) XP2.28
LVDS_TX_5-: DD5.Y10(3,_Y10,_IO,_DIFFIO_TX_RX_B16N) XP2.27
LVDS_TX_6+: DD5.V10(3,_V10,_IO,_DIFFIO_TX_RX_B12P) XP2.24
LVDS_TX_6-: DD5.V9(3,_V9,_IO,_DIFFIO_TX_RX_B12N) XP2.23
LVDS_TX_7+: DD5.AA7(3,_AA7,_IO,_DIFFIO_TX_RX_B10P) XP2.22
LVDS_TX_7-: DD5.AA6(3,_AA6,_IO,_DIFFIO_TX_RX_B10N) XP2.21
LVDS_TX_8+: DD5.W8(3,_W8,_IO,_DIFFIO_TX_RX_B7P) XP2.20
LVDS_TX_8-: DD5.W7(3,_W7,_IO,_DIFFIO_TX_RX_B7N) XP2.19
LVDS_TX_9+: DD5.U7(3,_U7,_IO,_DIFFIO_TX_RX_B3P) XP2.16
LVDS_TX_9-: DD5.U6(3,_U6,_IO,_DIFFIO_TX_RX_B3N) XP2.15
LVDS_TX_A+: DD5.W6(3,_W6,_IO,_DIFFIO_TX_RX_B1P) XP2.14
LVDS_TX_A-: DD5.W5(3,_W5,_IO,_DIFFIO_TX_RX_B1N) XP2.13
LVDS_TX_B+: DD5.W3(3,_W3,_IO,_DIFFIO_TX_RX_B5P) XP2.12
LVDS_TX_B-: DD5.W4(3,_W4,_IO,_DIFFIO_TX_RX_B5N) XP2.11
PB1: C5.1 DD5.M1(5,_M1,_IO) R1.1 SB1.2
PB2: C10.1 DD5.R1(2,_R1,_IO,_DIFFIO_RX_L28N) R2.1 SB2.2
PB3: C16.1 DD5.V5(3,_V5,_IO,_DIFFIO_RX_B2P) R4.1 SB3.2
PB4: C17.1 DD5.AB5(3,_AB5,_IO,_DIFFIO_RX_B11P) R13.1 SB4.2
PMOD_A_1: DD5.C20(6,_C20,_IO,_DIFFIO_RX_R32P) XS1.1
PMOD_A_2: DD5.D19(6,_D19,_IO,_DIFFIO_RX_R32N) XS1.3
PMOD_A_3: DD5.D18(6,_D18,_IO,_DIFFIO_RX_R34P) XS1.5
PMOD_A_4: DD5.E18(6,_E18,_IO,_DIFFIO_RX_R34N) XS1.7
PMOD_B_1: DD5.E19(6,_E19,_IO,_DIFFIO_RX_R29P) XS1.2
PMOD_B_2: DD5.F18(6,_F18,_IO,_DIFFIO_RX_R29N) XS1.4
PMOD_B_3: DD5.F20(6,_F20,_IO,_DIFFIO_RX_R24N) XS1.6
PMOD_B_4: DD5.G19(6,_G19,_IO,_DIFFIO_RX_R18N) XS1.8
PMOD_C_1: DD5.U18(5,_U18,_IO,_DIFFIO_RX_R1P) XS2.1
PMOD_C_2: DD5.U17(5,_U17,_IO,_DIFFIO_RX_R1N) XS2.3
PMOD_C_3: DD5.R18(5,_R18,_IO,_DIFFIO_RX_R10P) XS2.5
PMOD_C_4: DD5.P18(5,_P18,_IO,_DIFFIO_RX_R10N) XS2.7
PMOD_D_1: DD5.R14(5,_R14,_IO,_DIFFIO_RX_R3N) XS2.2
PMOD_D_2: DD5.R15(5,_R15,_IO,_DIFFIO_RX_R3P) XS2.4
PMOD_D_3: DD5.P15(5,_P15,_IO,_DIFFIO_RX_R8P) XS2.6
PMOD_D_4: DD5.P14(5,_P14,_IO,_DIFFIO_RX_R8N) XS2.8
RESET_EXP#: DD5.C2(8,_C2,_IO,_DIFFIO_RX_T27N) R14.2 XP1.3
SDRAM_A0: DD4.23(A0) DD5.T20(5,_T20,_IO,_DIFFIO_RX_R6P)
SDRAM_A1: DD4.24(A1) DD5.T19(5,_T19,_IO,_DIFFIO_RX_R5P)
SDRAM_A2: DD4.25(A2) DD5.T18(5,_T18,_IO,_DIFFIO_RX_R5N)
SDRAM_A3: DD4.26(A3) DD5.AA21(5,_AA21,_IO,_DIFFIO_RX_R2P)
SDRAM_A4: DD4.29(A4) DD5.AA22(5,_AA22,_IO,_DIFFIO_RX_R2N)
SDRAM_A5: DD4.30(A5) DD5.U22(5,_U22,_IO,_DIFFIO_RX_R7N)
SDRAM_A6: DD4.31(A6) DD5.T22(5,_T22,_IO,_DIFFIO_RX_R4N)
SDRAM_A7: DD4.32(A7) DD5.R22(5,_R22,_IO)
SDRAM_A8: DD4.33(A8) DD5.P20(5,_P20,_IO,_DIFFIO_RX_R11N)
SDRAM_A9: DD4.34(A9) DD5.P22(5,_P20,_IO,_DIFFIO_RX_R11N)
SDRAM_A10: DD4.22(A10) DD5.U21(5,_U21,_IO,_DIFFIO_RX_R7P)
SDRAM_A11: DD4.35(A11) DD5.P19(5,_P19,_IO,_DIFFIO_RX_R11P)
SDRAM_A12: DD4.36(A12) DD5.N20(6,_N20,_IO,_DIFFIO_RX_R23N)
SDRAM_BA0: DD4.20(BA0) DD5.R20(5,_R20,_IO,_DIFFIO_RX_R6N)
SDRAM_BA1: DD4.21(BA1) DD5.T21(5,_T21,_IO,_DIFFIO_RX_R4P)
SDRAM_CASn: DD4.17(~{CAS}) DD5.N21(5,_N21,_IO,_DIFFIO_RX_R13P)
SDRAM_CKE: DD4.37(CKE) DD5.N22(5,_N22,_IO,_DIFFIO_RX_R9N)
SDRAM_CLK: DD4.38(CLK) DD5.M22(5,_M22,_IO,_DIFFIO_RX_R13N)
SDRAM_CSn: DD4.19(~{CS}) DD5.P21(5,_P21,_IO,_DIFFIO_RX_R9P)
SDRAM_DQ0: DD4.2(DQ0) DD5.C22(6,_C22,_IO,_DIFFIO_RX_R25N)
SDRAM_DQ1: DD4.4(DQ1) DD5.D22(6,_D22,_IO,_DIFFIO_RX_R25P)
SDRAM_DQ2: DD4.5(DQ2) DD5.E22(6,_E22,_IO,_DIFFIO_RX_R21P)
SDRAM_DQ3: DD4.7(DQ3) DD5.F22(6,_F22,_IO,_DIFFIO_RX_R19N)
SDRAM_DQ4: DD4.8(DQ4) DD5.G22(6,_G22,_IO,_DIFFIO_RX_R19P)
SDRAM_DQ5: DD4.10(DQ5) DD5.H22(6,_H22,_IO,_DIFFIO_RX_R15P)
SDRAM_DQ6: DD4.11(DQ6) DD5.J22(6,_J22,_IO,_DIFFIO_RX_R17P)
SDRAM_DQ7: DD4.13(DQ7) DD5.K22(6,_K22,_IO,_CLK3P,_DIFFIO_RX_R16P)
SDRAM_DQ8: DD4.42(DQ8) DD5.K21(6,_K21,_IO,_CLK3N,_DIFFIO_RX_R16N)
SDRAM_DQ9: DD4.44(DQ9) DD5.J21(6,_J21,_IO,_DIFFIO_RX_R17N)
SDRAM_DQ10: DD4.45(DQ10) DD5.H21(6,_H21,_IO,_DIFFIO_RX_R15N)
SDRAM_DQ11: DD4.47(DQ11) DD5.G20(6,_G20,_IO,_DIFFIO_RX_R18P)
SDRAM_DQ12: DD4.48(DQ12) DD5.F21(6,_F21,_IO,_DIFFIO_RX_R24P)
SDRAM_DQ13: DD4.50(DQ13) DD5.E21(6,_E21,_IO,_DIFFIO_RX_R21N)
SDRAM_DQ14: DD4.51(DQ14) DD5.D21(6,_D21,_IO,_VREFB6N0,)
SDRAM_DQ15: DD4.53(DQ15) DD5.C21(6,_C21,_IO)
SDRAM_DQMH: DD4.39(DQMH) DD5.L22(5,_L22,_IO,_DIFFIO_RX_R12N)
SDRAM_DQML: DD4.15(DQML) DD5.L20(6,_L20,_IO,_DIFFIO_RX_R28N)
SDRAM_RASn: DD4.18(~{RAS}) DD5.M20(6,_M20,_IO,_DIFFIO_RX_R23P)
SDRAM_WEn: DD4.16(~{WE}) DD5.M21(5,_M21,_IO,__DIFFIO_RX_R12P)
USER_LED1: DD5.M2(5,_M2,_IO,_VREFB2N0) VD1.2
USER_LED2: DD5.N1(2,_N1,_IO,_DIFFIO_RX_L26P) VD2.2
USER_LED3: DD5.R2(2,_R2,_IO,_DIFFIO_RX_L28P) VD3.2
USER_LED4: DD5.T1(5,_T1,_IO,_DIFFIO_RX_L24N) VD4.2
USER_LED5: DD5.V4(3,_V4,_IO,_DIFFIO_RX_B2N) VD5.2
USER_LED6: DD5.T6(2,_T6,_IO,_PLL_L_CLKOUTP,_DIFFIO_RX_L27P) VD6.2
USER_LED7: DD5.AB4(3,_AB4,_IO) VD7.2
USER_LED8: DD5.AA5(3,_AA5,_IO,_DIFFIO_RX_B11N) VD8.2
NetC12_2: C12.2 C15.2 DD2.14(VS) R3.1
NetC13_2: C13.2 DD3.9(Vref) TP2.1(Pad)
NetC26_2: C26.2 DD5.G16(G16,_VCCD_PLL2) DD5.T7(T7,_VCCD_PLL1) L1.1
NetC28_2: C28.2 C30.2 C32.2 C34.2 DD5.H8(H8,_VCCA3) DD5.H15(H15,_VCCA2) DD5.R8(R8,_VCCA1) DD5.T15(T15,_VCCA4) L2.1
NetC35_2: C35.2 DD5.H6(H6,_ADC_VREF) L3.1
NetC36_2: C36.2 DD5.J7(J7,_VCCINT) L4.1
NetC37_2: C37.2 C38.2 DD5.H7(H7,_VCCA_ADC) L5.1
NetDD3_10: DD3.10(Vout) TP1.1(Pad)
NetDD5_F7: DD5.F7(8,_F7,_IO,_CRC_ERROR,_DIFFIO_RX_T22N) R16.1
NetDD5_F8: DD5.F8(8,_F8,_IO,_CONF_DONE,_DIFFIO_RX_T24N) R18.1
NetDD5_G9: DD5.G9(8,_G9,_IONSTATUS,_DIFFIO_RX_T24P) R17.1
NetDD5_H9: DD5.H9(8,_H9,_INPUT_ONLY,_NCONFIG,) R19.1
NetDD5_H10: DD5.H10(8,_H10,_IO,_BOOT_SEL,) X1.2
NetR5_1: R5.1 VD1.1
NetR6_1: R6.1 VD2.1
NetR7_1: R7.1 VD3.1
NetR8_1: R8.1 VD4.1
NetR9_1: R9.1 VD5.1
NetR10_1: R10.1 VD6.1
NetR11_1: R11.1 VD7.1
NetR12_1: R12.1 VD8.1
NetR20_1: R20.1 X1.1
NetR21_2: R21.2 X1.3
NetR26_1: R26.1 R27.2 VD9.1(Ref)

Not connected (* = marked no-connect by the designer): DD2 2(NC2) 3(RZV3) 5(RZV5) 10(RZV10) 15(NC15); DD4 40(NC); DD5 A15(7,_A15,_IO) AA3(3,_AA3,_IO,_VREFB3N0) AA9(3,_AA9,_IO,_DIFFIO_RX_B17N) AA13(4,_AA13,_IO,_VREFB4N0) AA16(4,_AA16,_IO,_DIFFIO_RX_B26P) AB9(3,_AB9,_IO,_DIFFIO_RX_B17P) AB16(4,_AB16,_IO,_DIFFIO_RX_B26N) AB17(4,_AB17,_IO,_DIFFIO_RX_B28N) AB18(4,_AB18,_IO,_DIFFIO_RX_B28P) B15(7,_B15,_IO,_VREFB7N0) D10(8,_D10,_IO,_DEV_OE,_DIFFIO_RX_T18P) W12(4,_W12,_IO,_DIFFIO_RX_B19N); XP1 44 68 69 70 71 72 73 74 75 77

### Notes on the sheet
- Перв. примен.
- Справ. №
- Подп. и дата
- Инв. № дубл.
- Взам. инв. №
- Разраб.
- Изм.
- Лист
- № докум.
- Подп.
- Дата
- Лит.
- Масса
- Масштаб
- Пров.
- Т.контр.
- Листов
- Инв. № подл.
- Утв.
- Н.контр.
- Копировал
- Формат А1
- (in symbol 2x20 pin headers (J4)) Цепь; Конт.; VCC3P3; I2C_SDA; I2C_SCL; GPIO_A; GPIO_B; GND; LVDS_TX_B-; LVDS_TX_B+; LVDS_TX_A-; LVDS_TX_A+; LVDS_TX_9-; LVDS_TX_9+; LVDS_TX_8-; LVDS_TX_8+; LVDS_TX_7-; LVDS_TX_7+; LVDS_TX_6-; LVDS_TX_6+; LVDS_TX_5-; LVDS_TX_5+; LVDS_TX_4-; LVDS_TX_4+; LVDS_TX_3-; LVDS_TX_3+; LVDS_TX_2-; LVDS_TX_2+; LVDS_TX_1-; LVDS_TX_1+; LVDS_TX_0-; LVDS_TX_0+
- (in symbol 2x20 pin headers (J5)) Цепь; Конт.; GPIO_01; GPIO_02; GPIO_03; GPIO_04; GPIO_05; GPIO_06; GPIO_07; GPIO_08; GPIO_09; GPIO_10; VCC5P0; GND; GPIO_11; GPIO_12; DIFF_RX_B+; DIFF_RX_B-; DIFF_RX_A+; DIFF_RX_A-; DIFF_RX_9+; DIFF_RX_9-; DIFF_RX_8+; DIFF_RX_8-; DIFF_RX_7+; DIFF_RX_7-; DIFF_RX_6+; DIFF_RX_6-; DIFF_RX_5+; DIFF_RX_5-; VCC3P3; DIFF_RX_4+; DIFF_RX_4-; DIFF_RX_3+; DIFF_RX_3-; DIFF_RX_2+; DIFF_RX_2-; DIFF_RX_1+; DIFF_RX_1-; DIFF_RX_0+; DIFF_RX_0-
- (in symbol 12-bit DAC) DAC
- (in symbol 80-pin edge connector (J2), part A) Цепь; Конт.; VCC3P3; RESET_EXP#; GND; EG_P1; EG_P35; EG_P2; EG_P36; EG_P3; EG_P4; EG_P37; EG_P5; EG_P38; EG_P6; EG_P39; EG_P7; EG_P40; EG_P8; EG_P41; EG_P9; EG_P42; EG_P10; EG_P43; EG_P11; EG_P44; EG_P12; EG_P45; EG_P13; EG_P46; EG_P14; EG_P47; EG_P15; EG_P48; EG_P16; EG_P49
- (in symbol 80-pin edge connector (J2), part B) Цепь; Конт.; EG_P17; EG_P50; EG_P18; GND; EG_P19; EG_P51; EG_P20; EG_P52; EG_P21; EG_P53; EG_P22; EG_P54; EG_P23; EG_P55; EG_P24; EG_P56; EG_P25; EG_P57; EG_P26; EG_P58; EG_P27; EG_P59; EG_P28; EG_P60; EG_P29; NC; EXP_PRESENT; VCC5P0
- (in symbol Jumper_J1) Цепь; Конт.; VCC3P3; VCCIO_power; VCC2P5
- (in symbol Jumper_J3) Цепь; Конт.; VCCIO_power; boot_sel; GND
- (in symbol Jumper_J9) Цепь; Конт.; VCC3P3; VCCIO_sdram; VCC2P5
- (in symbol MAX 10 FPGFA, part A) FPGA
- (in symbol MAX 10 FPGFA, part B) FPGA
- (in symbol Res_Thermistor) t
- (in symbol SDRAM 8 MB 54 pins) SDRAM
- (in symbol Сonnector  PMOD Female Header) Цепь; Конт.; IOA1; IOB1; IOA2; IOB2; IOA3; IOB3; IOA4; IOB4; GND; VCC

### Library data of the parts
BQ1 = Сlock 50 MHz 50ppm: Clock 50 MHZ  main clock for FPGA  3.2x2.5 mm 3.3V 6.5mA; Manufacturer: Silicon Labs; Name: 501HAA50M0000CAFR
C1 C3 C4 C6-C9 C18-C22 C24-C32 C34-C37 = Cap_0201: Non-polar Capacitor
  C1 C4 C7 C29 C31: Value: 1u
  C3 C6 C8 C19 C21 C24-C28 C30 C32 C34-C37: Value: 100n
  C9 C18 C20 C22: Value: 10n
C2 C5 C10-C17 = Cap_0402: Non-polar Capacitor
  C2 C11 C14: Value: 100n
  C5 C10 C12 C15-C17: Value: 1u
  C13: Value: 10n
C23 C33 C38 = Cap_0603: Non-polar Capacitor; Value: 10u
DD1 = 16Mb serial flash M25P16-VMN6: 16Mb serial flash off-chip processor code storage, etc; Manufacturer: Micron; Name: M25P16-VMN6
DD2 = Accelerometer 16 pins: Accelerometer ADXL362  2.5 or 3.3V 3uA; Manufacturer: ADI; Name: ADXL362BCCZ-RL7 SMD 16 pins
DD3 = 12-bit DAC: 12-bit DAC AD5681R; Manufacturer: ADI; Name: AD5681RBRMZ-RL7
DD4 = SDRAM 8 MB 54 pins: SDRAM 8 MB 3.3V 90mA; Manufacturer: ISSI; Name: IS42S16400J-7TL  TSOPII 4 pins
DD5 = MAX 10 FPGFA: MAX10 10M08DAF484; Manufacturer: ALTERA; Name: 10M08DAF484C8GES
DD6 = Temperature sensor ADT7420: ADT7420 16-lead LFCSP_WQ; Manufacturer: ADI; Name: ADT7420UCPZ-RL7
L1-L5 = Inductor: Inductor  4.7uH/600mA; Manufacturer: Murata; Name: LQM18PN4R7MFR; Value: 4.7u
R1-R4 R13-R26 R28 = Res_0402: Resistor
  R1 R2 R4 R13-R21: Value: 10k
  R3: Value: 0
  R22-R25: Value: 4.7k
  R26: Value: 12.1k
  R28: Value: 330
R5-R12 = Res_0603: Resistor; Value: 220
R27 = Res_Thermistor: Resistor; Value: *
SB1-SB4 = Button: SPST Micro SMD PushButton; Name: Micro SMD PushButton 3.7x6.1x2.5mm 2P; Manufacturer: *
TP1-TP3 = Testpoint: Standard Testing Point
VD1-VD8 = LED_green: LED GREEN CLEAR 2.3V 30mA 8-bit output, two for status; Manufacturer: Bet Lux Electronics; Name: BL-LS0603GC SMD
VD9 = Diode Adjustable Shunt Regulator (U14): SPX432 1.24V SOT-23; Manufacturer: Diodes Incorporated; Name: SPX432 1.24V SOT-23
X1 = Jumper_J3: Jumper 2.54mm pitch (default short PIN 1 and 2) 1x3_2.54mm boot select
X2 = Jumper_J9: Jumper 2.00mm pitch (default short PIN 1 and 2) 3.3V or 2.5V VCCIO selection 1x3_2.0mm
X3 = Jumper_J1: Jumper 2.00mm pitch (default short PIN 1 and 2) 3.3V or 2.5V VCCIO selection  1x3_2.0mm
XP1 = 80-pin edge connector (J2): MEC6-140_CARD; Name: MEC6-140_CARD
XP2 = 2x20 pin headers (J4): PIN_HEADER_2x20_2.54mm 2x 20 pin headers for expansion and loopback
XP3 = 2x20 pin headers (J5): PIN_HEADER_2x20_2.54mm 2x 20 pin headers for expansion and loopback
XS1 XS2 = Сonnector  PMOD Female Header: PMOD Female 2x6, 2.54 mm, DIP; Manufacturer: TE Connectivity AMP Connectors; Name: PMOD Connectors

## Sheet 02.SchDoc
size 840 x 594 mm; Разраб.: Гришель; Обозначение документа: ГУИР.421457.001 Э3; Пров.: Станкевич; Т.контр.: Станкевич; Н.контр.: Лихачёв; Утв.: Петровский; Номер листа: 2; Общее количество листов: 2; Литера: Т; Наименование организации: БГУИР, гр. 250701; Наименование изделия 1: Плата отладочная; Наименование изделия 2: Схема электрическая; Наименование изделия 3: принципиальная; Нач. отд.: Реценз.
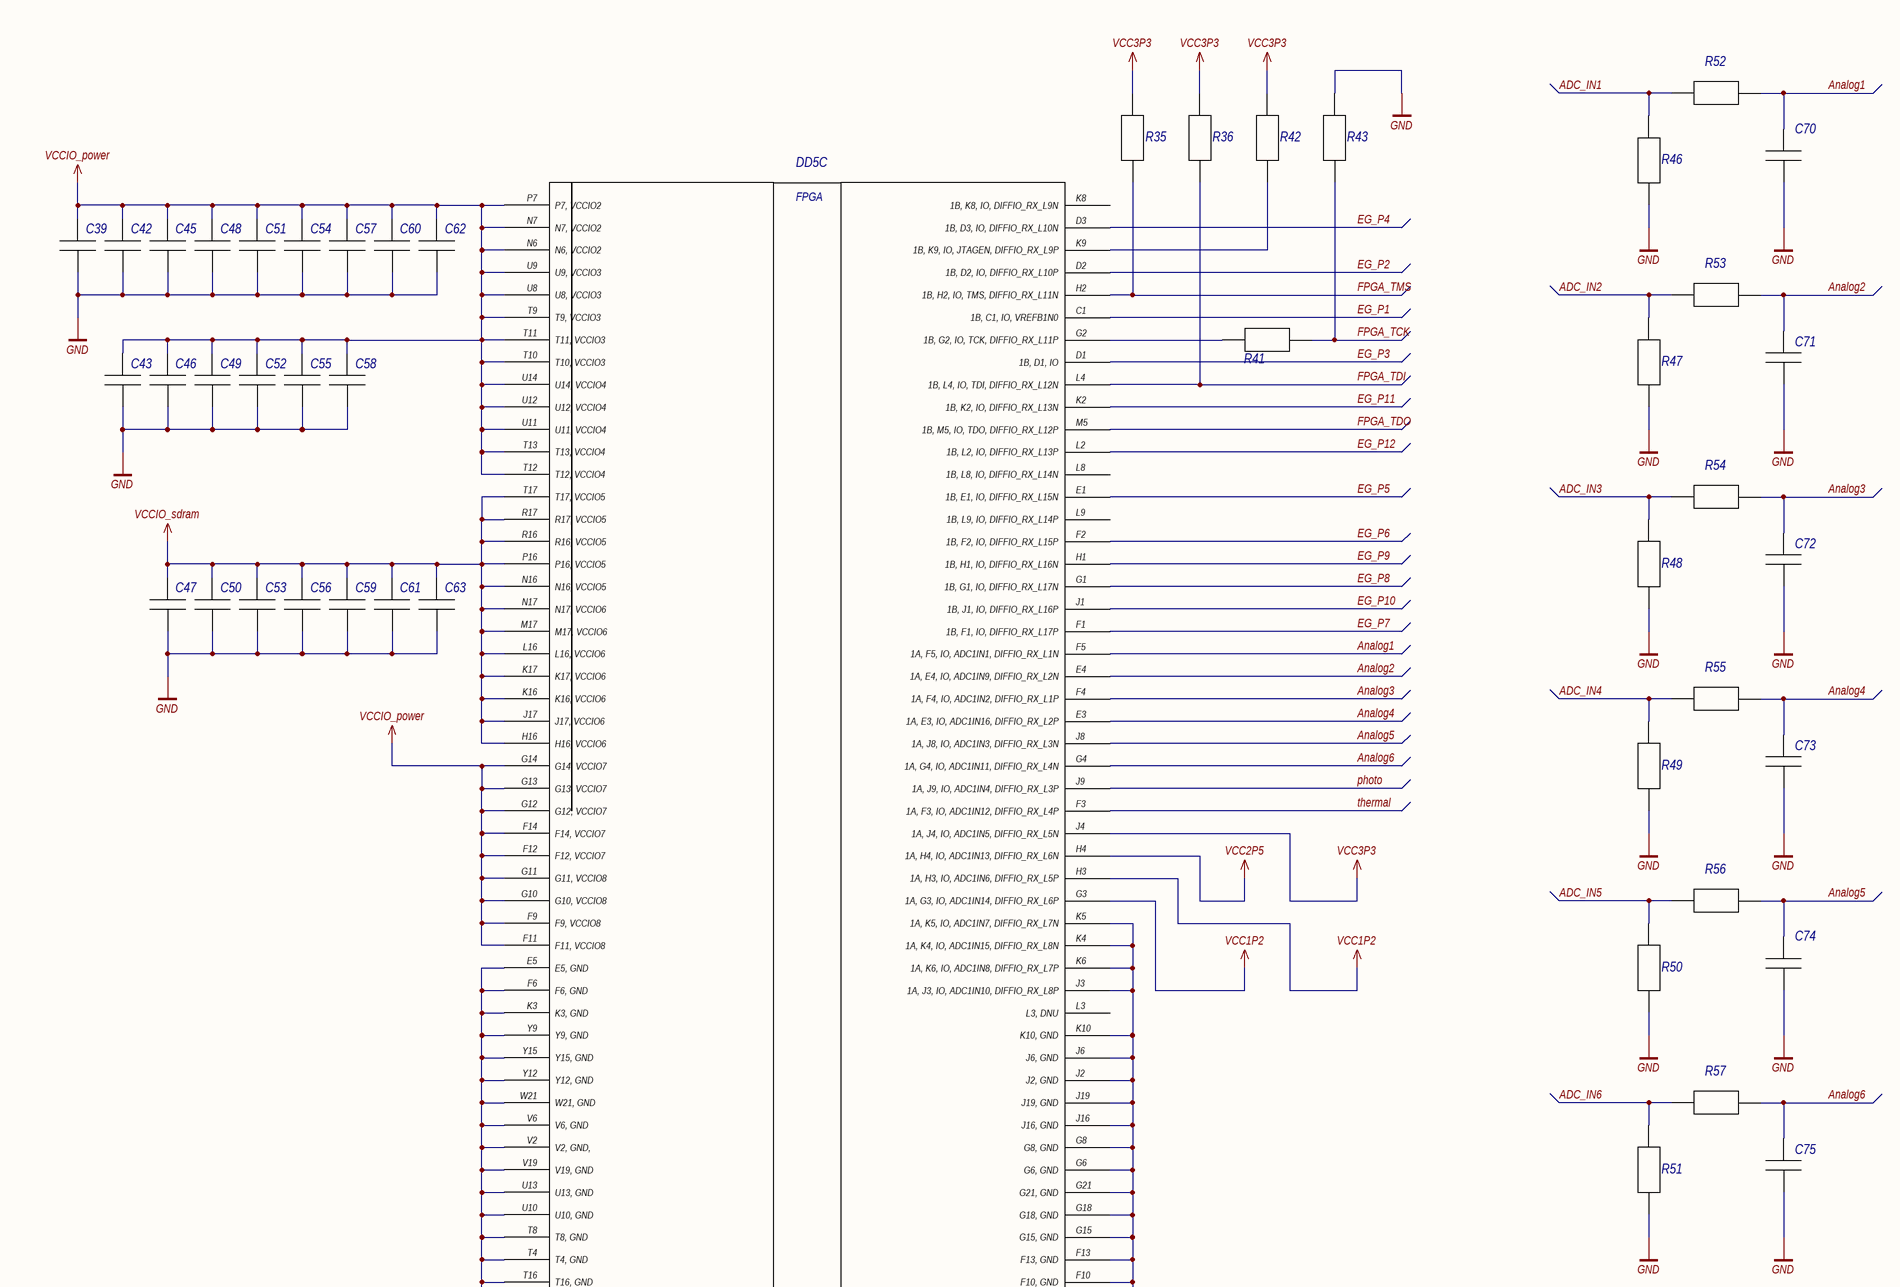
[diagram p4: 02.SchDoc, top left]
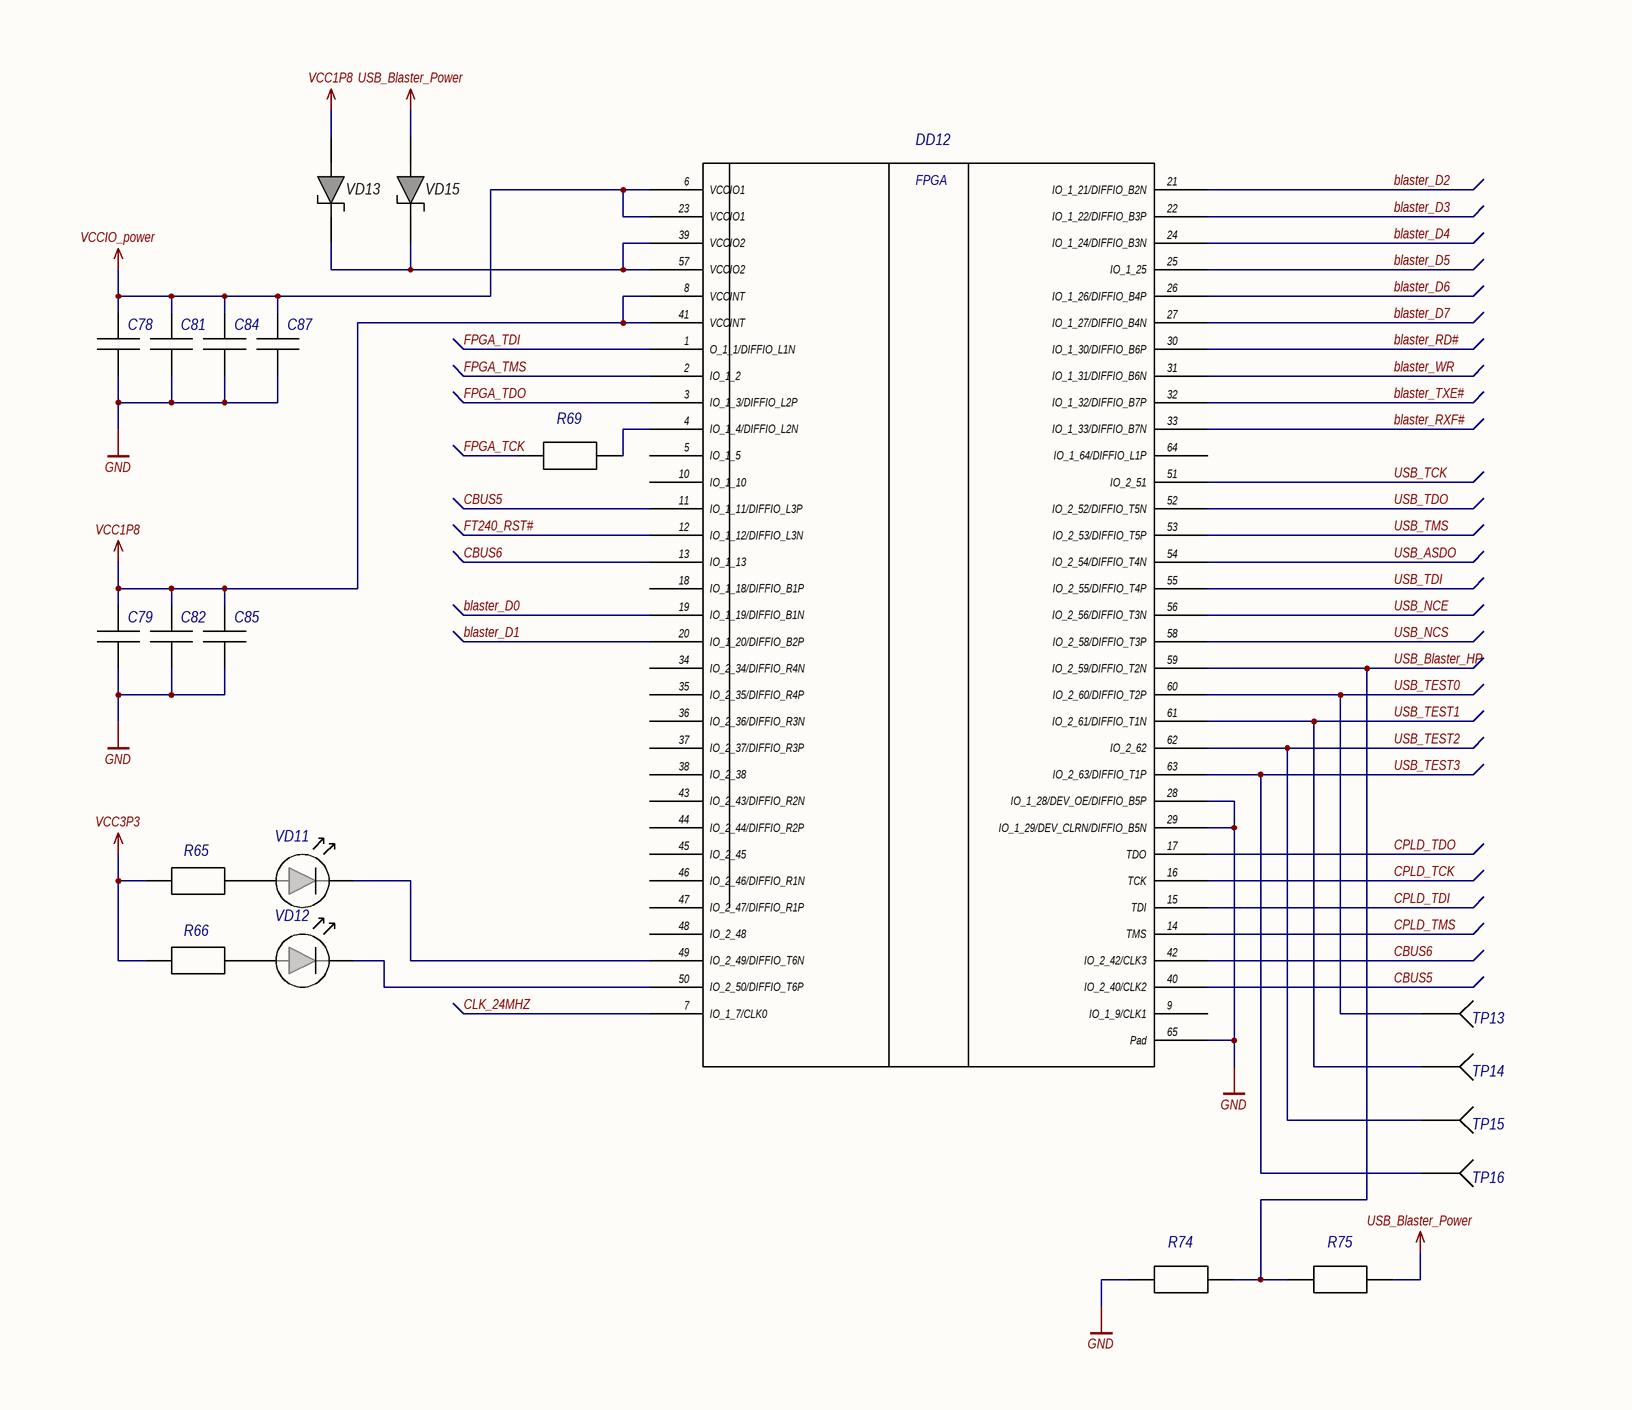
[diagram p5: 02.SchDoc, top right]
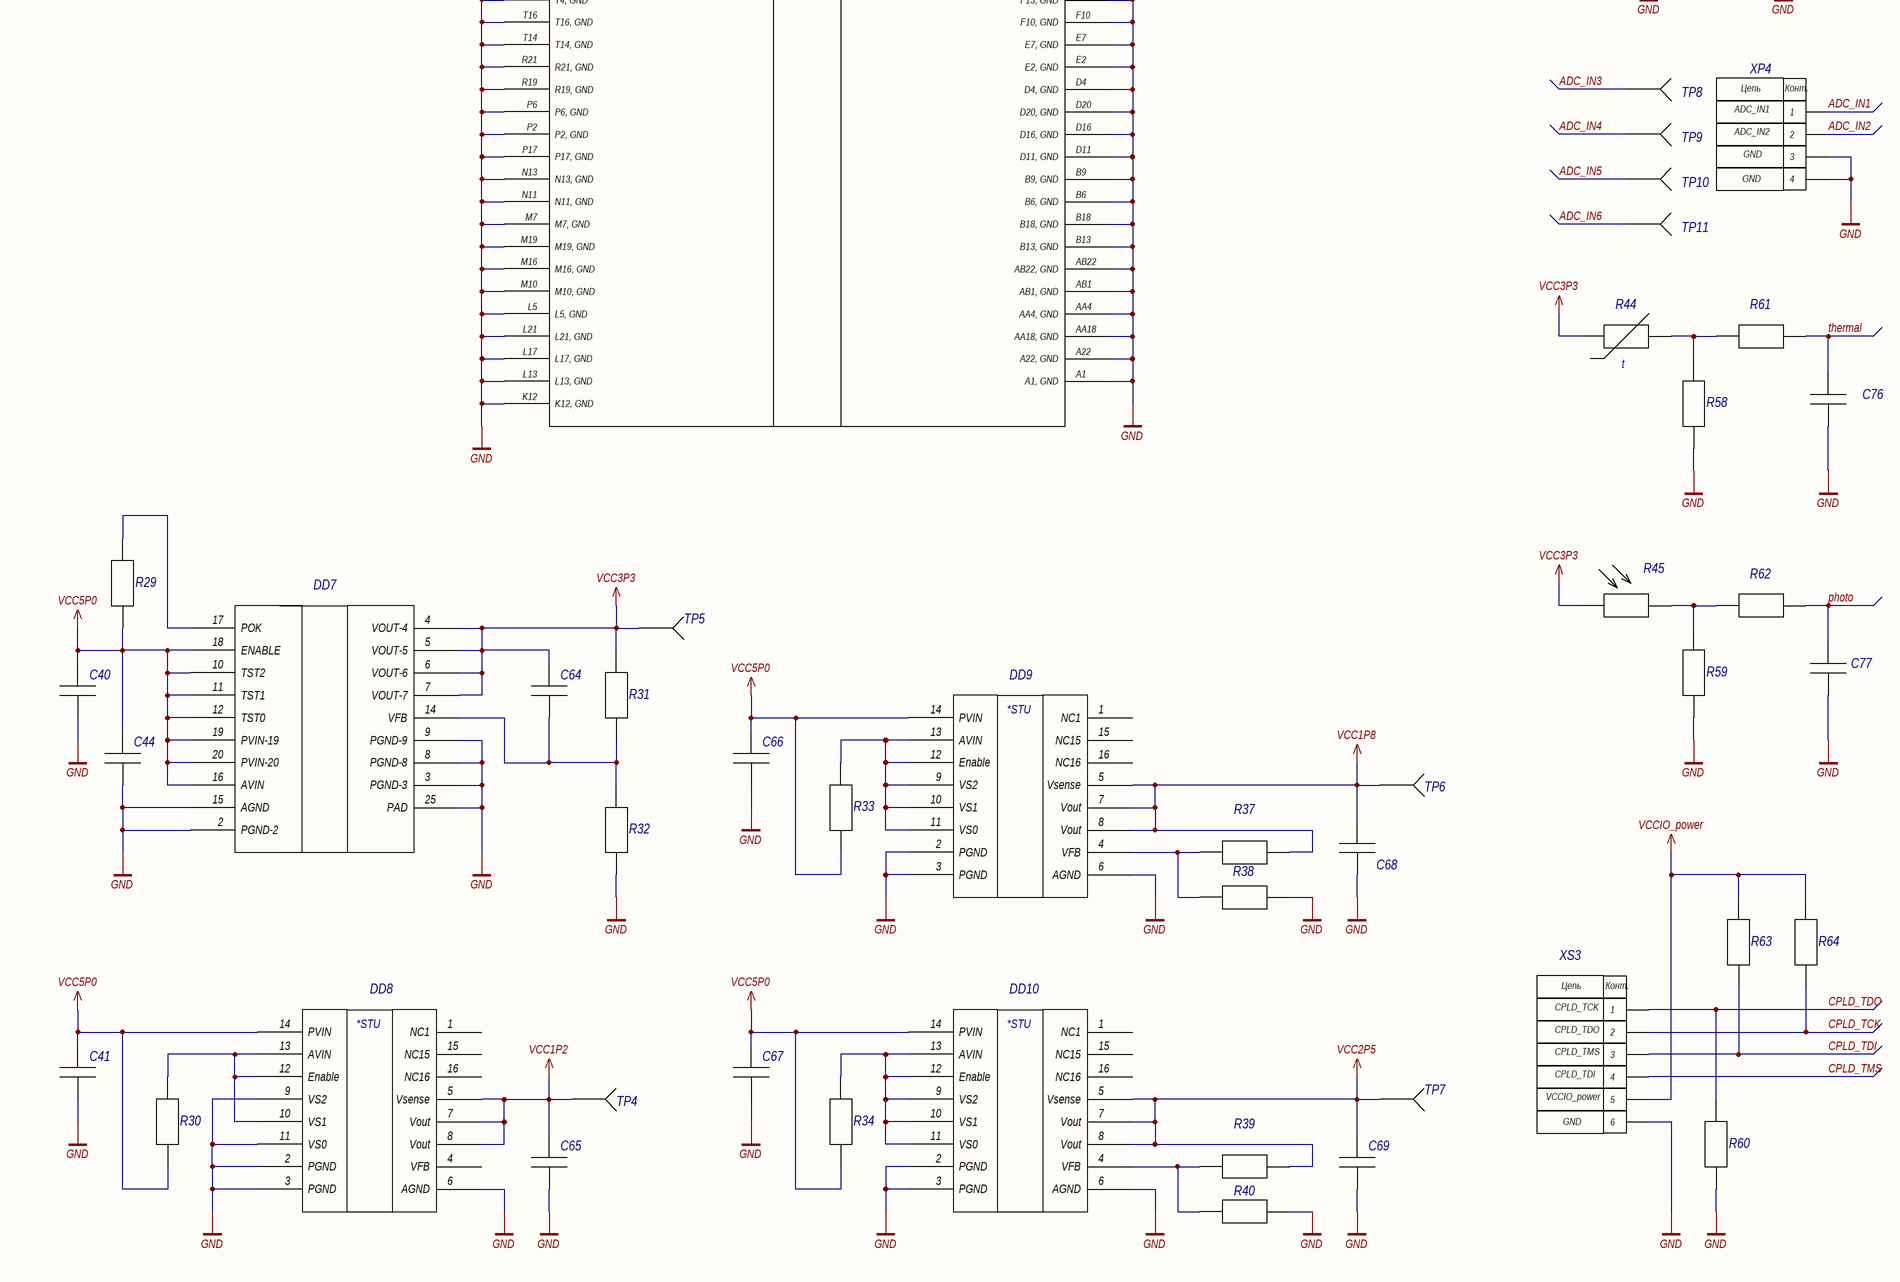
[diagram p6: 02.SchDoc, bottom left]
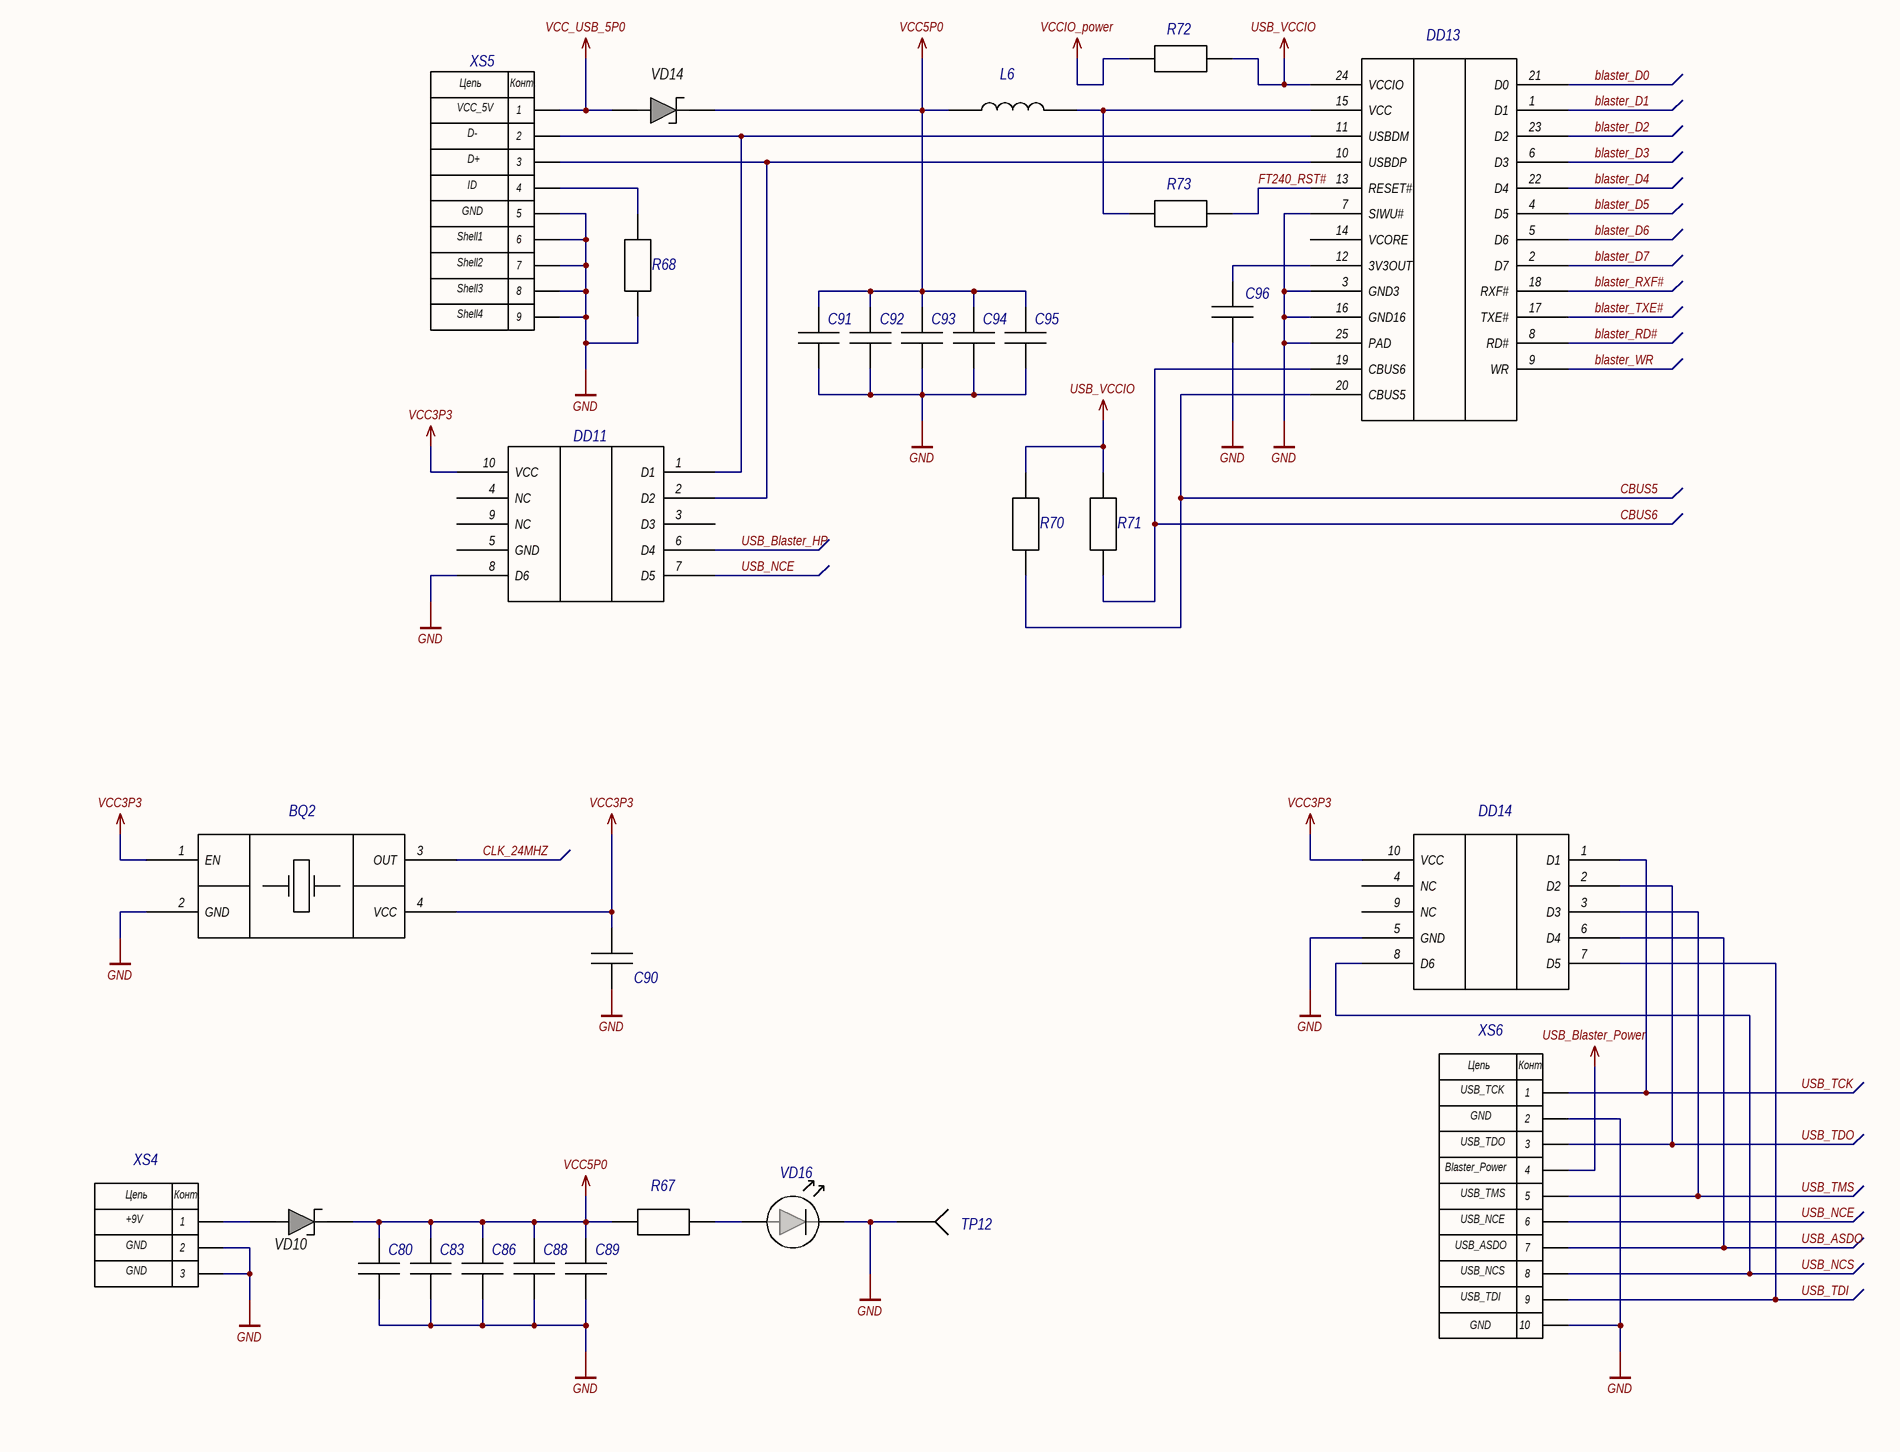
[diagram p7: 02.SchDoc, bottom right]

### Parts
BQ2  Clock 24 MHz 50ppm DNI  [Crystal_Clock_SMD]  (value not drawn)
C39  10u  [Cap_0603]  (value not drawn)
C40  10u  [Cap_0805]  (value not drawn)
C41  4.7u  [Cap_0603]  (value not drawn)
C42  1u  [CAPC0603X03L]  (value not drawn)
C43  10u  [Cap_0603]  (value not drawn)
C44  1u  [Cap_0603]  (value not drawn)
C45  1u  [CAPC0603X03L]  (value not drawn)
C46  1u  [CAPC0603X03L]  (value not drawn)
C47  10u  [Cap_0603]  (value not drawn)
C48  100n  [CAPC0603X03L]  (value not drawn)
C49  100n  [CAPC0603X03L]  (value not drawn)
C50  1u  [CAPC0603X03L]  (value not drawn)
C51  100n  [CAPC0603X03L]  (value not drawn)
C52  100n  [CAPC0603X03L]  (value not drawn)
C53  100n  [CAPC0603X03L]  (value not drawn)
C54  100n  [CAPC0603X03L]  (value not drawn)
C55  10n  [CAPC0603X03L]  (value not drawn)
C56  100n  [CAPC0603X03L]  (value not drawn)
C57  10n  [CAPC0603X03L]  (value not drawn)
C58  10n  [CAPC0603X03L]  (value not drawn)
C59  10n  [CAPC0603X03L]  (value not drawn)
C60  10n  [CAPC0603X03L]  (value not drawn)
C61  10n  [CAPC0603X03L]  (value not drawn)
C62  10n  [CAPC0603X03L]  (value not drawn)
C63  100n  [CAPC0603X03L]  (value not drawn)
C64  6.8p  [CAPC0603X03L]  (value not drawn)
C65  10u  [Cap_0805]  (value not drawn)
C66  4.7u  [Cap_0603]  (value not drawn)
C67  4.7u  [Cap_0603]  (value not drawn)
C68  10u  [Cap_0805]  (value not drawn)
C69  10u  [Cap_0805]  (value not drawn)
C70  100n  [CAPC0603X03L]  (value not drawn)
C71  100n  [CAPC0603X03L]  (value not drawn)
C72  100n  [CAPC0603X03L]  (value not drawn)
C73  100n  [CAPC0603X03L]  (value not drawn)
C74  100n  [CAPC0603X03L]  (value not drawn)
C75  100n  [CAPC0603X03L]  (value not drawn)
C76  100n  [Cap_0402]  (value not drawn)
C77  100n  [Cap_0402]  (value not drawn)
C78  10u  [Cap_0603]  (value not drawn)
C79  10u  [Cap_0603]  (value not drawn)
C80  22u  [Cap_0603]  (value not drawn)
C81  100n  [CAPC0603X03L]  (value not drawn)
C82  100n  [CAPC0603X03L]  (value not drawn)
C83  10u  [Cap_0603]  (value not drawn)
C84  100n  [CAPC0603X03L]  (value not drawn)
C85  100n  [CAPC0603X03L]  (value not drawn)
C86  1u  [Cap_0603]  (value not drawn)
C87  100n  [CAPC0603X03L]  (value not drawn)
C88  100n  [Cap_0603]  (value not drawn)
C89  10n  [Cap_0603]  (value not drawn)
C90  100n  [Cap_0402]  (value not drawn)
C91  10u  [Cap_0603]  (value not drawn)
C92  1u  [CAPC0603X03L]  (value not drawn)
C93  100n  [CAPC0603X03L]  (value not drawn)
C94  22u  [Cap_0603]  (value not drawn)
C95  10n  [CAPC0603X03L]  (value not drawn)
C96  100n  [CAPC0603X03L]  (value not drawn)
DD5  MAX 10 FPGFA  [10M08DAF484_V2]  (value not drawn)  (part C of 3)
DD7  Enpirion Power Supply, Vout 3.3V  - 24 pin  [Enpirion Power Supply_Vout 3.3V _24pin]  (value not drawn)
DD8  Enpirion Power Supply, Vout 2.5V, 1.8V, 1.5V  [Enpirion Power Supply_Vout 2.5V, 1.8V, 1.5V_16pin]  (value not drawn)
DD9  Enpirion Power Supply, Vout 2.5V, 1.8V, 1.5V  [Enpirion Power Supply_Vout 2.5V, 1.8V, 1.5V_16pin]  (value not drawn)
DD10  Enpirion Power Supply, Vout 2.5V, 1.8V, 1.5V  [Enpirion Power Supply_Vout 2.5V, 1.8V, 1.5V_16pin]  (value not drawn)
DD11  ESD for USB Bluster  [ESD_TPD6E001RSER]  (value not drawn)
DD12  MAX V 5M80ZE64  [MAX V 5M80ZE64]  (value not drawn)
DD13  FT240XQ FTDI for USB Bluster 24 pin  [FFTDI_240XQ-T]  (value not drawn)
DD14  ESD for USB Bluster  [ESD_TPD6E001RSER]  (value not drawn)
L6  4.7u  [Inductor]  (value not drawn)
R29  100k  [RESISTOR_0402]  (value not drawn)
R30  100  [RESISTOR_0402]  (value not drawn)
R31  348k  [RESISTOR_0402]  (value not drawn)
R32  76.8k  [RESISTOR_0402]  (value not drawn)
R33  100  [RESISTOR_0402]  (value not drawn)
R34  100  [RESISTOR_0402]  (value not drawn)
R35  10k  [RESISTOR_0402]  (value not drawn)
R36  10k  [RESISTOR_0402]  (value not drawn)
R37  75k  [RESISTOR_0402]  (value not drawn)
R38  118k  [RESISTOR_0402]  (value not drawn)
R39  75k  [RESISTOR_0402]  (value not drawn)
R40  75k  [RESISTOR_0402]  (value not drawn)
R41  22  [RESISTOR_0402]  (value not drawn)
R42  10k  [RESISTOR_0402]  (value not drawn)
R43  1k  [RESISTOR_0402]  (value not drawn)
R44  *  [Thermistor]  (value not drawn)
R45  *  [Light Sensor]  (value not drawn)
R46  49.9k  [RESISTOR_0402]  (value not drawn)
R47  49.9k  [RESISTOR_0402]  (value not drawn)
R48  49.9k  [RESISTOR_0402]  (value not drawn)
R49  49.9k  [RESISTOR_0402]  (value not drawn)
R50  49.9k  [RESISTOR_0402]  (value not drawn)
R51  49.9k  [RESISTOR_0402]  (value not drawn)
R52  12.7  [RESISTOR_0402]  (value not drawn)
R53  12.7  [RESISTOR_0402]  (value not drawn)
R54  12.7  [RESISTOR_0402]  (value not drawn)
R55  12.7  [RESISTOR_0402]  (value not drawn)
R56  12.7  [RESISTOR_0402]  (value not drawn)
R57  12.7  [RESISTOR_0402]  (value not drawn)
R58  1k  [RESISTOR_0402]  (value not drawn)
R59  1k  [RESISTOR_0402]  (value not drawn)
R60  1k  [RESISTOR_0402]  (value not drawn)
R61  12.7  [RESISTOR_0402]  (value not drawn)
R62  12.7  [RESISTOR_0402]  (value not drawn)
R63  10k  [RESISTOR_0402]  (value not drawn)
R64  10k  [RESISTOR_0402]  (value not drawn)
R65  220  [Resistor_0603]  (value not drawn)
R66  220  [Resistor_0603]  (value not drawn)
R67  680  [Resistor_0603]  (value not drawn)
R68  100k  [RESISTOR_0402]  (value not drawn)
R69  22  [RESISTOR_0402]  (value not drawn)
R70  10k  [RESISTOR_0402]  (value not drawn)
R71  10k  [RESISTOR_0402]  (value not drawn)
R72  0  [RESISTOR_0402]  (value not drawn)
R73  10k  [RESISTOR_0402]  (value not drawn)
R74  10k  [RESISTOR_0402]  (value not drawn)
R75  1k  [RESISTOR_0402]  (value not drawn)
TP4  Testpoint  [TP]  (value not drawn)  (no BOM)
TP5  Testpoint  [TP]  (value not drawn)  (no BOM)
TP6  Testpoint  [TP]  (value not drawn)  (no BOM)
TP7  Testpoint  [TP]  (value not drawn)  (no BOM)
TP8  Testpoint  [TP]  (value not drawn)  (no BOM)
TP9  Testpoint  [TP]  (value not drawn)  (no BOM)
TP10  Testpoint  [TP]  (value not drawn)  (no BOM)
TP11  Testpoint  [TP]  (value not drawn)  (no BOM)
TP12  Testpoint  [TP]  (value not drawn)  (no BOM)
TP13  Testpoint  [TP]  (value not drawn)  (no BOM)
TP14  Testpoint  [TP]  (value not drawn)  (no BOM)
TP15  Testpoint  [TP]  (value not drawn)  (no BOM)
TP16  Testpoint  [TP]  (value not drawn)  (no BOM)
VD10  Diode_SMA (D13, D15)  [Diode_VS_SMA]  (value not drawn)
VD11  LED_green  [LED_smd]  (value not drawn)
VD12  LED_green  [LED_smd]  (value not drawn)
VD13  Diode (D9)  [Diode_BAT54C]  (value not drawn)
VD14  Diode_SMA (D13, D15)  [Diode_VS_SMA]  (value not drawn)
VD15  Diode (D9)  [Diode_BAT54C]  (value not drawn)
VD16  LED_red  [LED_smd]  (value not drawn)
XP4  Jumper_J11  [CONN_J11-PIN_HEADER_2x2_2.54mm]  (value not drawn)
XS3  JTAG connection to MAX V  (J6)  [CONN_J6_PIN_HEADER_1x6_2.54mm(DNI)]  (value not drawn)
XS4  Power Jack  (J10)  [CONN_Power_Jack]  (value not drawn)
XS5  Mini USB connector 9pins (J8)  [CONN_MiniUSB]  (value not drawn)
XS6  Edge connector for USB-Blaster output  (J7)  [CONN_J7_PIN_HEADER_2x5_2.54mm(DNI)]  (value not drawn)

### Nets
GND: BQ2.2(GND) C39.1 C40.1 C41.1 C42.1 C43.1 C44.1 C45.1 C46.1 C47.1 C48.1 C49.1 C50.1 C51.1 C52.1 C53.1 C54.1 C55.1 C56.1 C57.1 C58.1 C59.1 C60.1 C61.1 C62.1 C63.1 C65.1 C66.1 C67.1 C68.1 C69.1 C70.1 C71.1 C72.1 C73.1 C74.1 C75.1 C76.1 C77.1 C78.1 C79.1 C80.1 C81.1 C82.1 C83.1 C84.1 C85.1 C86.1 C87.1 C88.1 C89.1 C90.1 C91.1 C92.1 C93.1 C94.1 C95.1 C96.1 DD5.A1(A1,_GND) DD5.A22(A22,_GND) DD5.AA4(AA4,_GND) DD5.AA18(AA18,_GND) DD5.AB1(AB1,_GND) DD5.AB22(AB22,_GND) DD5.B6(B6,_GND) DD5.B9(B9,_GND) DD5.B13(B13,_GND) DD5.B18(B18,_GND) DD5.D4(D4,_GND) DD5.D11(D11,_GND) DD5.D16(D16,_GND) DD5.D20(D20,_GND) DD5.E2(E2,_GND) DD5.E5(E5,_GND) DD5.E7(E7,_GND) DD5.F6(F6,_GND) DD5.F10(F10,_GND) DD5.F13(F13,_GND) DD5.G6(G6,_GND) DD5.G8(G8,_GND) DD5.G15(G15,_GND) DD5.G18(G18,_GND) DD5.G21(G21,_GND) DD5.J2(J2,_GND) DD5.J3(1A,_J3,_IO,_ADC1IN10,_DIFFIO_RX_L8P) DD5.J6(J6,_GND) DD5.J16(J16,_GND) DD5.J19(J19,_GND) DD5.K3(K3,_GND) DD5.K4(1A,_K4,_IO,_ADC1IN15,_DIFFIO_RX_L8N) DD5.K5(1A,_K5,_IO,_ADC1IN7,_DIFFIO_RX_L7N) DD5.K6(1A,_K6,_IO,_ADC1IN8,_DIFFIO_RX_L7P) DD5.K10(K10,_GND) DD5.K12(K12,_GND) DD5.L5(L5,_GND) DD5.L13(L13,_GND) DD5.L17(L17,_GND) DD5.L21(L21,_GND) DD5.M7(M7,_GND) DD5.M10(M10,_GND) DD5.M16(M16,_GND) DD5.M19(M19,_GND) DD5.N11(N11,_GND) DD5.N13(N13,_GND) DD5.P2(P2,_GND) DD5.P6(P6,_GND) DD5.P17(P17,_GND) DD5.R19(R19,_GND) DD5.R21(R21,_GND) DD5.T4(T4,_GND) DD5.T8(T8,_GND) DD5.T14(T14,_GND) DD5.T16(T16,_GND) DD5.U10(U10,_GND) DD5.U13(U13,_GND) DD5.V2(V2,_GND,) DD5.V6(V6,_GND) DD5.V19(V19,_GND) DD5.W21(W21,_GND) DD5.Y9(Y9,_GND) DD5.Y12(Y12,_GND) DD5.Y15(Y15,_GND) DD7.2(PGND-2) DD7.3(PGND-3) DD7.8(PGND-8) DD7.9(PGND-9) DD7.15(AGND) DD7.25(PAD) DD8.2(PGND) DD8.3(PGND) DD8.6(AGND) DD8.9(VS2) DD8.11(VS0) DD8.17 DD9.2(PGND) DD9.3(PGND) DD9.6(AGND) DD9.17 DD10.2(PGND) DD10.3(PGND) DD10.6(AGND) DD10.17 DD11.8(D6) DD12.28(IO_1_28/DEV_OE/DIFFIO_B5P) DD12.29(IO_1_29/DEV_CLRN/DIFFIO_B5N) DD12.65(Pad) DD13.3(GND3) DD13.7(SIWU#) DD13.16(GND16) DD13.25(PAD) DD14.5(GND) R32.1 R38.1 R40.1 R43.2 R46.2 R47.2 R48.2 R49.2 R50.2 R51.2 R58.1 R59.1 R60.1 R68.1 R74.1 TP12.1(Pad) VD16.2 XP4.3 XP4.4 XS3.6 XS4.2 XS4.3 XS5.5 XS5.6 XS5.7 XS5.8 XS5.9 XS6.2 XS6.10
USB_Blaster_Power: R75.2 VD15.2 XS6.4
USB_VCCIO: DD13.24(VCCIO) R70.2 R71.2 R72.2
VCC1P2: C65.2 DD5.G3(1A,_G3,_IO,_ADC1IN14,_DIFFIO_RX_L6P) DD5.H3(1A,_H3,_IO,_ADC1IN6,_DIFFIO_RX_L5P) DD8.5(Vsense) DD8.7(Vout) DD8.8(Vout) TP4.1(Pad)
VCC1P8: C68.2 C79.2 C82.2 C85.2 DD9.5(Vsense) DD9.7(Vout) DD9.8(Vout) DD12.8(VCCINT) DD12.41(VCCINT) R37.1 TP6.1(Pad) VD13.2
VCC2P5: C69.2 DD5.H4(1A,_H4,_IO,_ADC1IN13,_DIFFIO_RX_L6N) DD10.5(Vsense) DD10.7(Vout) DD10.8(Vout) R39.1 TP7.1(Pad)
VCC3P3: BQ2.1(EN) BQ2.4(VCC) C64.2 C90.2 DD5.J4(1A,_J4,_IO,_ADC1IN5,_DIFFIO_RX_L5N) DD7.4(VOUT-4) DD7.5(VOUT-5) DD7.6(VOUT-6) DD7.7(VOUT-7) DD11.10(VCC) DD14.10(VCC) R31.2 R35.2 R36.2 R42.2 R44.1 R45.1 R65.2 R66.2 TP5.1(Pad)
VCC5P0: C40.2 C41.2 C44.2 C66.2 C67.2 C80.2 C83.2 C86.2 C88.2 C89.2 C91.2 C92.2 C93.2 C94.2 C95.2 DD7.10(TST2) DD7.11(TST1) DD7.12(TST0) DD7.16(AVIN) DD7.18(ENABLE) DD7.19(PVIN-19) DD7.20(PVIN-20) DD8.14(PVIN) DD9.14(PVIN) DD10.14(PVIN) L6.1 R29.1 R30.1 R33.1 R34.1 R67.1 VD10.1 VD14.1
VCC_USB_5P0: VD14.2 XS5.1
VCCIO_power: C39.2 C42.2 C43.2 C45.2 C46.2 C48.2 C49.2 C51.2 C52.2 C54.2 C55.2 C57.2 C58.2 C60.2 C62.2 C78.2 C81.2 C84.2 C87.2 DD5.F9(F9,_VCCIO8) DD5.F11(F11,_VCCIO8) DD5.F12(F12,_VCCIO7) DD5.F14(F14,_VCCIO7) DD5.G10(G10,_VCCIO8) DD5.G11(G11,_VCCIO8) DD5.G12(G12,_VCCIO7) DD5.G13(G13,_VCCIO7) DD5.G14(G14,_VCCIO7) DD5.N6(N6,_VCCIO2) DD5.N7(N7,_VCCIO2) DD5.P7(P7,_VCCIO2) DD5.T9(T9,_VCCIO3) DD5.T10(T10,_VCCIO3) DD5.T11(T11,_VCCIO3) DD5.T12(T12,_VCCIO4) DD5.T13(T13,_VCCIO4) DD5.U8(U8,_VCCIO3) DD5.U9(U9,_VCCIO3) DD5.U11(U11,_VCCIO4) DD5.U12(U12,_VCCIO4) DD5.U14(U14,_VCCIO4) DD12.6(VCCIO1) DD12.23(VCCIO1) R63.2 R64.2 R72.1 XS3.5
VCCIO_sdram: C47.2 C50.2 C53.2 C56.2 C59.2 C61.2 C63.2 DD5.H16(H16,_VCCIO6) DD5.J17(J17,_VCCIO6) DD5.K16(K16,_VCCIO6) DD5.K17(K17,_VCCIO6) DD5.L16(L16,_VCCIO6) DD5.M17(M17,_VCCIO6) DD5.N16(N16,_VCCIO5) DD5.N17(N17,_VCCIO6) DD5.P16(P16,_VCCIO5) DD5.R16(R16,_VCCIO5) DD5.R17(R17,_VCCIO5) DD5.T17(T17,_VCCIO5)
ADC_IN1: R46.1 R52.1 XP4.1
ADC_IN2: R47.1 R53.1 XP4.2
ADC_IN3: R48.1 R54.1 TP8.1(Pad)
ADC_IN4: R49.1 R55.1 TP9.1(Pad)
ADC_IN5: R50.1 R56.1 TP10.1(Pad)
ADC_IN6: R51.1 R57.1 TP11.1(Pad)
Analog1: C70.2 DD5.F5(1A,_F5,_IO,_ADC1IN1,_DIFFIO_RX_L1N) R52.2
Analog2: C71.2 DD5.E4(1A,_E4,_IO,_ADC1IN9,_DIFFIO_RX_L2N) R53.2
Analog3: C72.2 DD5.F4(1A,_F4,_IO,_ADC1IN2,_DIFFIO_RX_L1P) R54.2
Analog4: C73.2 DD5.E3(1A,_E3,_IO,_ADC1IN16,_DIFFIO_RX_L2P) R55.2
Analog5: C74.2 DD5.J8(1A,_J8,_IO,_ADC1IN3,_DIFFIO_RX_L3N) R56.2
Analog6: C75.2 DD5.G4(1A,_G4,_IO,_ADC1IN11,_DIFFIO_RX_L4N) R57.2
blaster_D0: DD12.19(IO_1_19/DIFFIO_B1N) DD13.21(D0)
blaster_D1: DD12.20(IO_1_20/DIFFIO_B2P) DD13.1(D1)
blaster_D2: DD12.21(IO_1_21/DIFFIO_B2N) DD13.23(D2)
blaster_D3: DD12.22(IO_1_22/DIFFIO_B3P) DD13.6(D3)
blaster_D4: DD12.24(IO_1_24/DIFFIO_B3N) DD13.22(D4)
blaster_D5: DD12.25(IO_1_25) DD13.4(D5)
blaster_D6: DD12.26(IO_1_26/DIFFIO_B4P) DD13.5(D6)
blaster_D7: DD12.27(IO_1_27/DIFFIO_B4N) DD13.2(D7)
blaster_RD#: DD12.30(IO_1_30/DIFFIO_B6P) DD13.8(RD#)
blaster_RXF#: DD12.33(IO_1_33/DIFFIO_B7N) DD13.18(RXF#)
blaster_TXE#: DD12.32(IO_1_32/DIFFIO_B7P) DD13.17(TXE#)
blaster_WR: DD12.31(IO_1_31/DIFFIO_B6N) DD13.9(WR)
CBUS5: DD12.11(IO_1_11/DIFFIO_L3P) DD12.40(IO_2_40/CLK2) DD13.20(CBUS5) R70.1
CBUS6: DD12.13(IO_1_13) DD12.42(IO_2_42/CLK3) DD13.19(CBUS6) R71.1
CLK_24MHZ: BQ2.3(OUT) DD12.7(IO_1_7/CLK0)
CPLD_TCK: DD12.16(TCK) R64.1 XS3.2
CPLD_TDI: DD12.15(TDI) R63.1 XS3.3
CPLD_TDO: DD12.17(TDO) R60.2 XS3.1
CPLD_TMS: DD12.14(TMS) XS3.4
EG_P1: DD5.C1(1B,_C1,_IO,_VREFB1N0)
EG_P2: DD5.D2(1B,_D2,_IO,_DIFFIO_RX_L10P)
EG_P3: DD5.D1(1B,_D1,_IO)
EG_P4: DD5.D3(1B,_D3,_IO,_DIFFIO_RX_L10N)
EG_P5: DD5.E1(1B,_E1,_IO,_DIFFIO_RX_L15N)
EG_P6: DD5.F2(1B,_F2,_IO,_DIFFIO_RX_L15P)
EG_P7: DD5.F1(1B,_F1,_IO,_DIFFIO_RX_L17P)
EG_P8: DD5.G1(1B,_G1,_IO,_DIFFIO_RX_L17N)
EG_P9: DD5.H1(1B,_H1,_IO,_DIFFIO_RX_L16N)
EG_P10: DD5.J1(1B,_J1,_IO,_DIFFIO_RX_L16P)
EG_P11: DD5.K2(1B,_K2,_IO,_DIFFIO_RX_L13N)
EG_P12: DD5.L2(1B,_L2,_IO,_DIFFIO_RX_L13P)
FPGA_TCK: R41.1 R43.1 R69.1
FPGA_TDI: DD5.L4(1B,_L4,_IO,_TDI,_DIFFIO_RX_L12N) DD12.1(O_1_1/DIFFIO_L1N) R36.1
FPGA_TDO: DD5.M5(1B,_M5,_IO,_TDO,_DIFFIO_RX_L12P) DD12.3(IO_1_3/DIFFIO_L2P)
FPGA_TMS: DD5.H2(1B,_H2,_IO,_TMS,_DIFFIO_RX_L11N) DD12.2(IO_1_2) R35.1
FT240_RST#: DD12.12(IO_1_12/DIFFIO_L3N) DD13.13(RESET#) R73.2
photo: C77.2 DD5.J9(1A,_J9,_IO,_ADC1IN4,_DIFFIO_RX_L3P) R62.1
thermal: C76.2 DD5.F3(1A,_F3,_IO,_ADC1IN12,_DIFFIO_RX_L4P) R61.1
USB_ASDO: DD12.54(IO_2_54/DIFFIO_T4N) DD14.6(D4) XS6.7
USB_Blaster_HP: DD11.6(D4) DD12.59(IO_2_59/DIFFIO_T2N) R74.2 R75.1
USB_NCE: DD11.7(D5) DD12.56(IO_2_56/DIFFIO_T3N) XS6.6
USB_NCS: DD12.58(IO_2_58/DIFFIO_T3P) DD14.8(D6) XS6.8
USB_TCK: DD12.51(IO_2_51) DD14.1(D1) XS6.1
USB_TDI: DD12.55(IO_2_55/DIFFIO_T4P) DD14.7(D5) XS6.9
USB_TDO: DD12.52(IO_2_52/DIFFIO_T5N) DD14.2(D2) XS6.3
USB_TEST0: DD12.60(IO_2_60/DIFFIO_T2P) TP13.1(Pad)
USB_TEST1: DD12.61(IO_2_61/DIFFIO_T1N) TP14.1(Pad)
USB_TEST2: DD12.62(IO_2_62) TP15.1(Pad)
USB_TEST3: DD12.63(IO_2_63/DIFFIO_T1P) TP16.1(Pad)
USB_TMS: DD12.53(IO_2_53/DIFFIO_T5P) DD14.3(D3) XS6.5
NetC64_1: C64.1 DD7.14(VFB) R31.1 R32.2
NetC96_2: C96.2 DD13.12(3V3OUT)
NetDD5_G2: DD5.G2(1B,_G2,_IO,_TCK,_DIFFIO_RX_L11P) R41.2
NetDD5_K9: DD5.K9(1B,_K9,_IO,_JTAGEN,_DIFFIO_RX_L9P) R42.1
NetDD7_17: DD7.17(POK) R29.2
NetDD8_10: DD8.10(VS1) DD8.12(Enable) DD8.13(AVIN) R30.2
NetDD9_4: DD9.4(VFB) R37.2 R38.2
NetDD9_9: DD9.9(VS2) DD9.10(VS1) DD9.11(VS0) DD9.12(Enable) DD9.13(AVIN) R33.2
NetDD10_4: DD10.4(VFB) R39.2 R40.2
NetDD10_9: DD10.9(VS2) DD10.10(VS1) DD10.11(VS0) DD10.12(Enable) DD10.13(AVIN) R34.2
NetDD11_1: DD11.1(D1) DD13.11(USBDM) XS5.2
NetDD11_2: DD11.2(D2) DD13.10(USBDP) XS5.3
NetDD12_4: DD12.4(IO_1_4/DIFFIO_L2N) R69.2
NetDD12_39: DD12.39(VCCIO2) DD12.57(VCCIO2) VD13.1 VD15.1
NetDD12_49: DD12.49(IO_2_49/DIFFIO_T6N) VD11.2
NetDD12_50: DD12.50(IO_2_50/DIFFIO_T6P) VD12.2
NetDD13_15: DD13.15(VCC) L6.2 R73.1
NetR44_2: R44.2 R58.2 R61.2
NetR45_2: R45.2 R59.2 R62.2
NetR65_1: R65.1 VD11.1
NetR66_1: R66.1 VD12.1
NetR67_2: R67.2 VD16.1
NetR68_2: R68.2 XS5.4
NetVD10_2: VD10.2 XS4.1

Not connected (* = marked no-connect by the designer): DD5 K8(1B,_K8,_IO,_DIFFIO_RX_L9N) L3(L3,_DNU) L8(1B,_L8,_IO,_DIFFIO_RX_L14N) L9(1B,_L9,_IO,_DIFFIO_RX_L14P); DD8 1(NC1) 4(VFB) 15(NC15) 16(NC16); DD9 1(NC1) 15(NC15) 16(NC16); DD10 1(NC1) 15(NC15) 16(NC16); DD11 3(D3) 4(NC) 5(GND) 9(NC); DD12 5(IO_1_5) 9(IO_1_9/CLK1) 10(IO_1_10) 18(IO_1_18/DIFFIO_B1P) 34(IO_2_34/DIFFIO_R4N) 35(IO_2_35/DIFFIO_R4P) 36(IO_2_36/DIFFIO_R3N) 37(IO_2_37/DIFFIO_R3P) 38(IO_2_38) 43(IO_2_43/DIFFIO_R2N) 44(IO_2_44/DIFFIO_R2P) 45(IO_2_45) 46(IO_2_46/DIFFIO_R1N) 47(IO_2_47/DIFFIO_R1P) 48(IO_2_48) 64(IO_1_64/DIFFIO_L1P); DD13 14(VCORE); DD14 4(NC) 9(NC)

### Notes on the sheet
- Подп. и дата
- Инв. № дубл.
- Взам. инв. №
- Инв. № подл.
- Изм.
- Лист
- № докум.
- Подп.
- Дата
- Копировал
- Формат А1
- (in symbol Edge connector for USB-Blaster output  (J7)) Цепь; Конт.; USB_TCK; GND; USB_TDO; Blaster_Power; USB_TMS; USB_NCE; USB_ASDO; USB_NCS; USB_TDI
- (in symbol Enpirion Power Supply, Vout 2.5V, 1.8V, 1.5V) *STU
- (in symbol JTAG connection to MAX V  (J6)) Цепь; Конт.; CPLD_TCK; CPLD_TDO; CPLD_TMS; CPLD_TDI; VCCIO_power; GND
- (in symbol Jumper_J11) Цепь; Конт.; ADC_IN1; ADC_IN2; GND
- (in symbol MAX 10 FPGFA, part C) FPGA
- (in symbol MAX V 5M80ZE64) FPGA
- (in symbol Mini USB connector 9pins (J8)) Цепь; Конт.; VCC_5V; D-; D+; ID; GND; Shell1; Shell2; Shell3; Shell4
- (in symbol Power Jack  (J10)) Цепь; Конт.; +9V; GND
- (in symbol Res_Thermistor) t

### Library data of the parts
BQ2 = Clock 24 MHz 50ppm DNI: Clock 24 MHz  secondary clock   3.2x2.5 mm; Manufacturer: Silicon Labs; Name: 501HAA24M0000CAFR
C39 C41 C43 C44 C47 C66 C67 C78-C80 C83 C86 C88 C89 C91 C94 = Cap_0603: Non-polar Capacitor
  C39 C43 C47 C78 C79 C83 C91: Value: 10u
  C41 C66 C67: Value: 4.7u
  C44 C86: Value: 1u
  C80 C94: Value: 22u
  C88: Value: 100n
  C89: Value: 10n
C40 C65 C68 C69 = Cap_0805: Non-polar Capacitor; Value: 10u
C42 C45 C46 C48-C64 C70-C75 C81 C82 C84 C85 C87 C92 C93 C95 C96 = Cap_0201: Non-polar Capacitor
  C42 C45 C46 C50 C92: Value: 1u
  C48 C49 C51-C54 C56 C63 C70-C75 C81 C82 C84 C85 C87 C93 C96: Value: 100n
  C55 C57-C62 C95: Value: 10n
  C64: Value: 6.8p
C76 C77 C90 = Cap_0402: Non-polar Capacitor; Value: 100n
DD5 = MAX 10 FPGFA: as DD5 on sheet 01
DD7 = Enpirion Power Supply, Vout 3.3V  - 24 pin: EN5329QI 24-pin (4 x 6 x 1.1mm) QFN T&R; 3.3; Manufacturer: ALTERA; Name: EN5329QI
DD8-DD10 = Enpirion Power Supply, Vout 2.5V, 1.8V, 1.5V: EP53A8LQI 16-pin QFN T&R;  2.5, 1.8, 1.2; Manufacturer: ALTERA; Name: EP53A8LQI
DD11 DD14 = ESD for USB Bluster: TPD6E001RSER, ESD QFN10-RSE; Manufacturer: Texas Instruments; Name: TPD6E001RSER
DD12 = MAX V 5M80ZE64: required for USB Blaster  SQFP7x7-64-EXP; Manufacturer: ALTERA; Name: 5M80ZE64C5N
DD13 = FT240XQ FTDI for USB Bluster 24 pin: FT240XQ FTDI for USB Bluster; Name: FT240XQ-T; Manufacturer: FTDI
L6 = Inductor: as L1 on sheet 01; Value: 4.7u
R29-R43 R46-R64 R68-R75 = Res_0402: Resistor
  R29 R68: Value: 100k
  R30 R33 R34: Value: 100
  R31: Value: 348k
  R32: Value: 76.8k
  R35 R36 R42 R63 R64 R70 R71 R73 R74: Value: 10k
  R37 R39 R40: Value: 75k
  R38: Value: 118k
  R41 R69: Value: 22
  R43 R58-R60 R75: Value: 1k
  R46-R51: Value: 49.9k
  R52-R57 R61 R62: Value: 12.7
  R72: Value: 0
R44 = Res_Thermistor: Resistor; Value: *
R45 = Res_Photoresistor: CDS Photo Resistor PGM5526  Light sensor; Manufacturer: Token; Value: *; Name: PGM5526
R65-R67 = Res_0603: Resistor
  R65 R66: Value: 220
  R67: Value: 680
TP4-TP16 = Testpoint: Standard Testing Point
VD10 VD14 = Diode_SMA (D13, D15): DIODE SCHOTTKY B360A 60V 0,5mA SMA; Manufacturer: Diodes Incorporated; Name: B360A
VD11 VD12 = LED_green: as VD1 on sheet 01
VD13 VD15 = Diode (D9): DIODE SCHOTTKY  BAT54C 30V 200mA SOT23; Manufacturer: Fairchild Semiconductor; Name: BAT54C
VD16 = LED_red: LED RED CLEAR 2.2V 30mA Power led; Manufacturer: Bet Lux Electronics; Name: BL-LS0603HC SMD
XP4 = Jumper_J11: Jumper Analog input (AIN1 and AIN2)  4 pin 2x2_2.54mm; Name: Jumper Analog input (AIN1 and AIN2)  4 pin 2x2_2.54mm
XS3 = JTAG connection to MAX V  (J6): PIN_HEADER_1x6_2.54mm(DNI); Name: PIN_HEADER_1x6_2.54mm(DNI)
XS4 = Power Jack  (J10): Power Jack, 4.5mm_1.3mm
XS5 = Mini USB connector 9pins (J8): USB-Blaster connector; Name: Mini USB connector
XS6 = Edge connector for USB-Blaster output  (J7): PIN_HEADER_2x5_2.54mm(DNI); Name: PIN_HEADER_2x5_2.54mm(DNI)

## Nets that join several sheets
GND: 01 (92 pins), 02 (180 pins)
VCC1P2: 01 (22 pins), 02 (7 pins)
VCC2P5: 01 (11 pins), 02 (7 pins)
VCC3P3: 01 (53 pins), 02 (20 pins)
VCC5P0: 01 (XP1.79 XP1.80 XP3.11), 02 (33 pins)
VCCIO_power: 01 (7 pins), 02 (47 pins)
VCCIO_sdram: 01 (DD2.1 R3.2 X2.2), 02 (19 pins)
CLK_24MHZ: 01 (DD5.N15), 02 (BQ2.3 DD12.7)
EG_P1: 01 (XP1.5), 02 (DD5.C1)
EG_P2: 01 (XP1.7), 02 (DD5.D2)
EG_P3: 01 (XP1.9), 02 (DD5.D1)
EG_P4: 01 (XP1.11), 02 (DD5.D3)
EG_P5: 01 (XP1.13), 02 (DD5.E1)
EG_P6: 01 (XP1.15), 02 (DD5.F2)
EG_P7: 01 (XP1.17), 02 (DD5.F1)
EG_P8: 01 (XP1.19), 02 (DD5.G1)
EG_P9: 01 (XP1.23), 02 (DD5.H1)
EG_P10: 01 (XP1.25), 02 (DD5.J1)
EG_P11: 01 (XP1.27), 02 (DD5.K2)
EG_P12: 01 (XP1.29), 02 (DD5.L2)